# Altium project CT8042.PrjPcb (part 1 of 2)
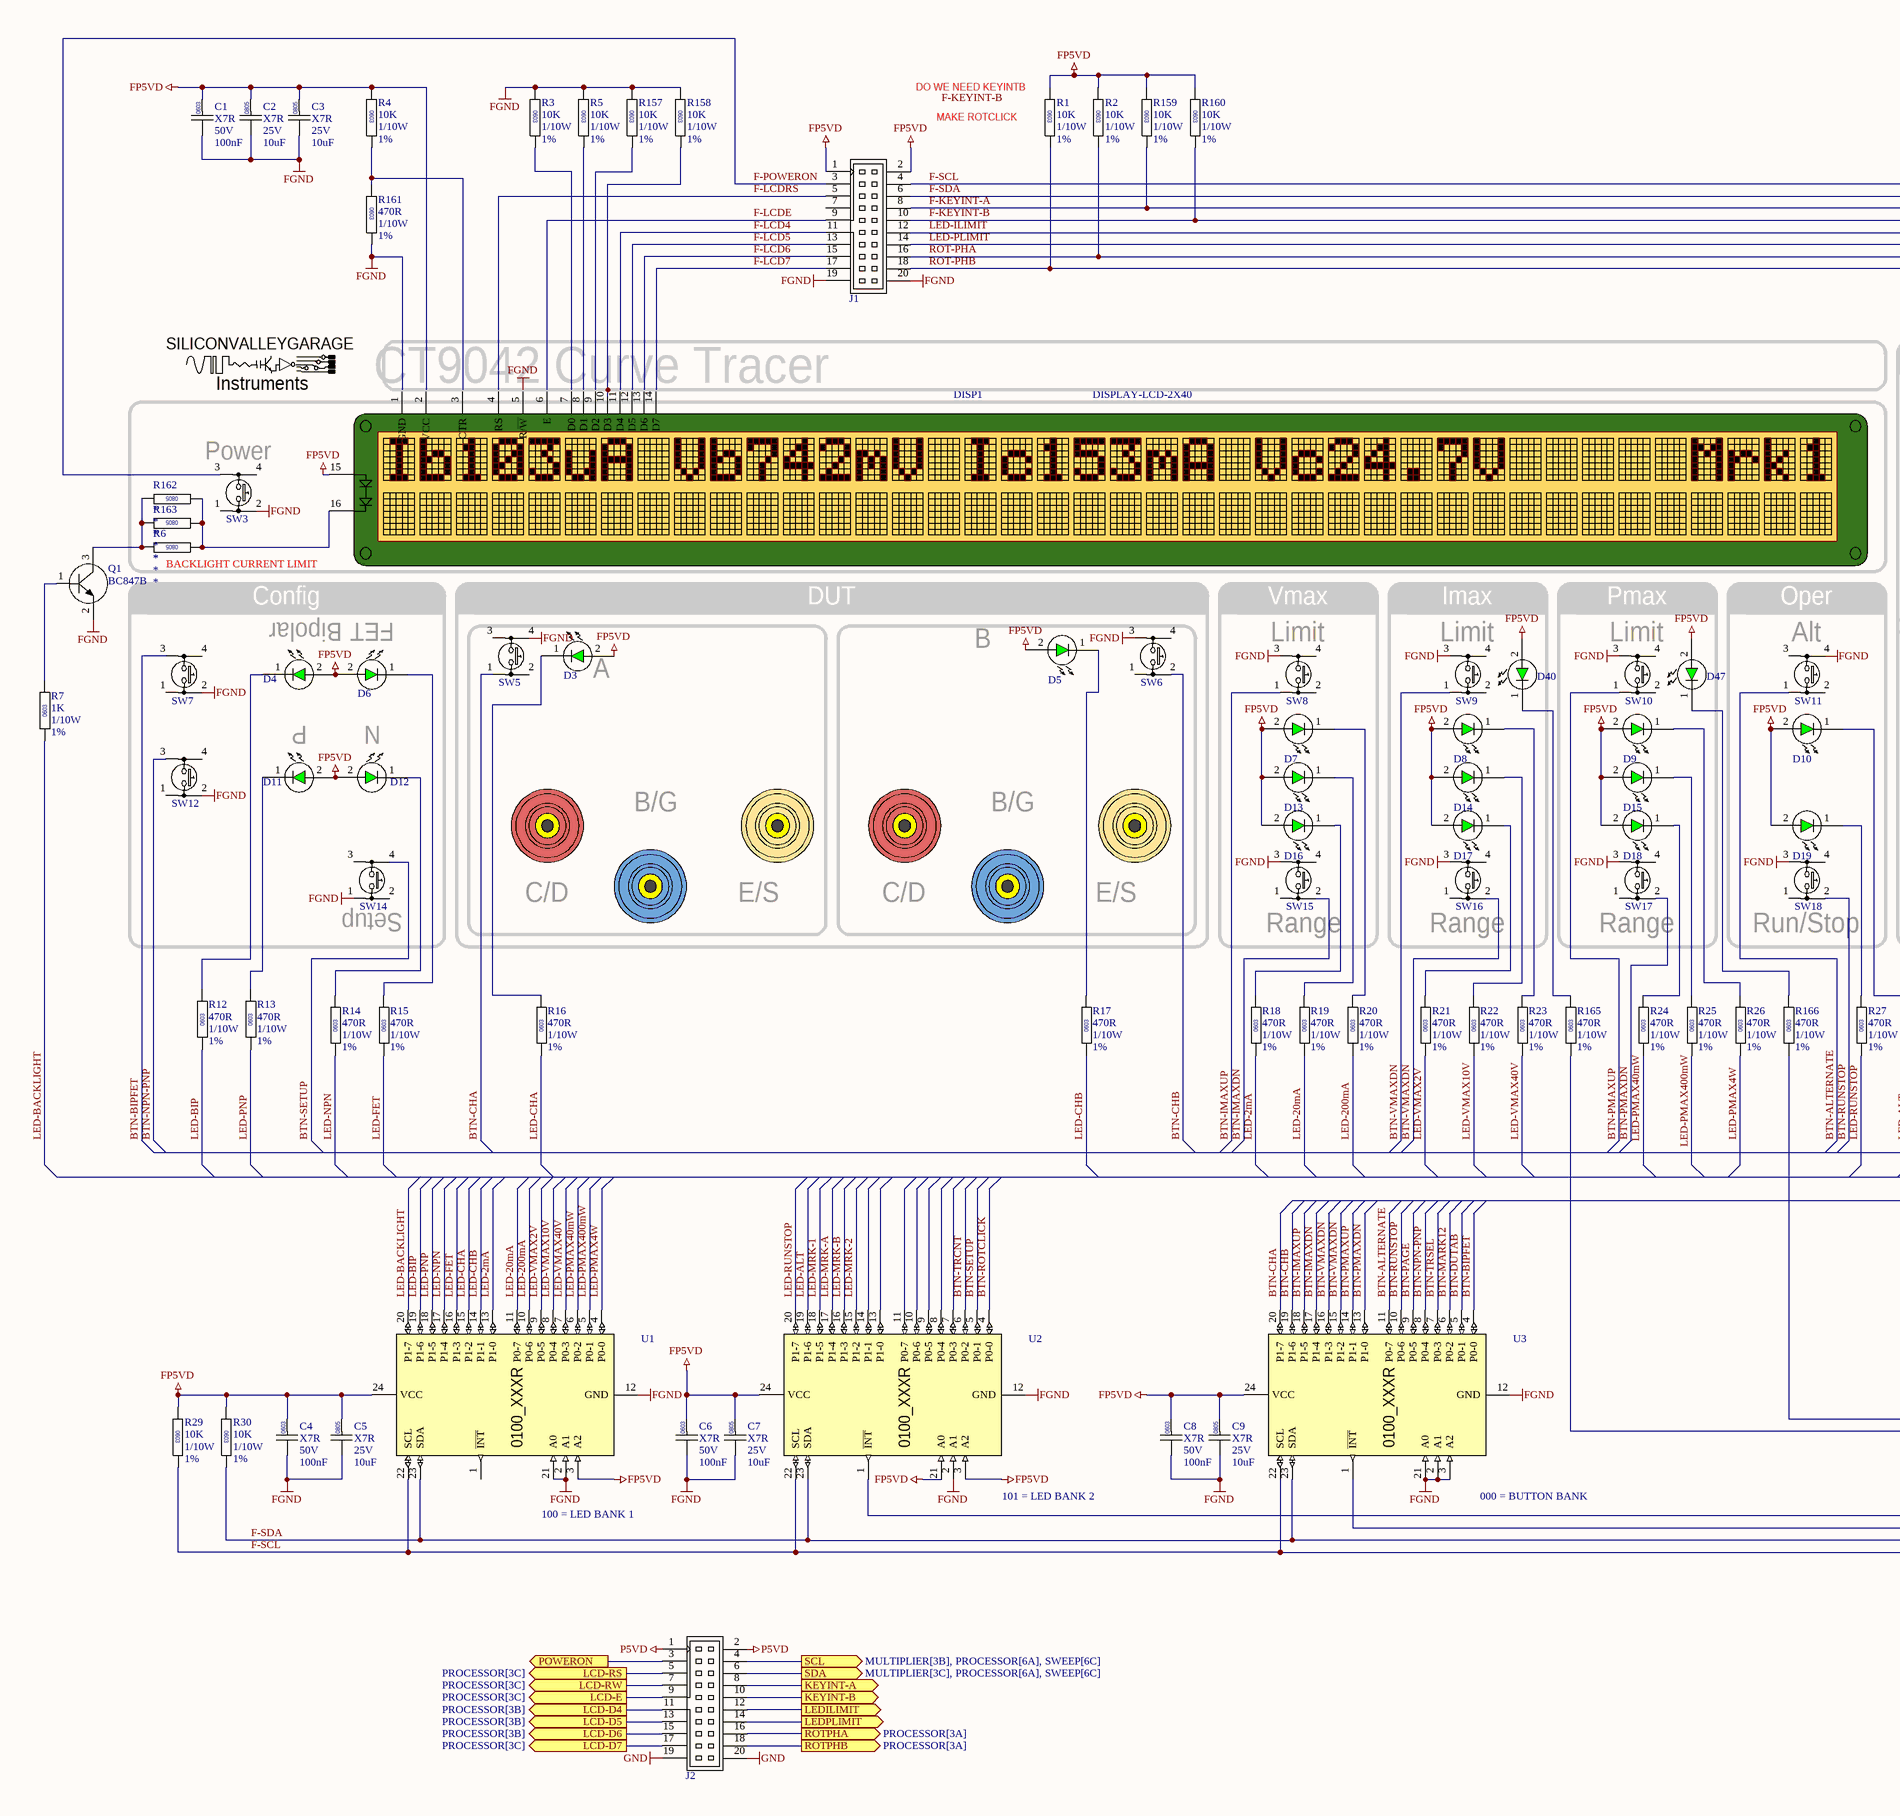
[diagram p0: FrontPanel.SchDoc, left]
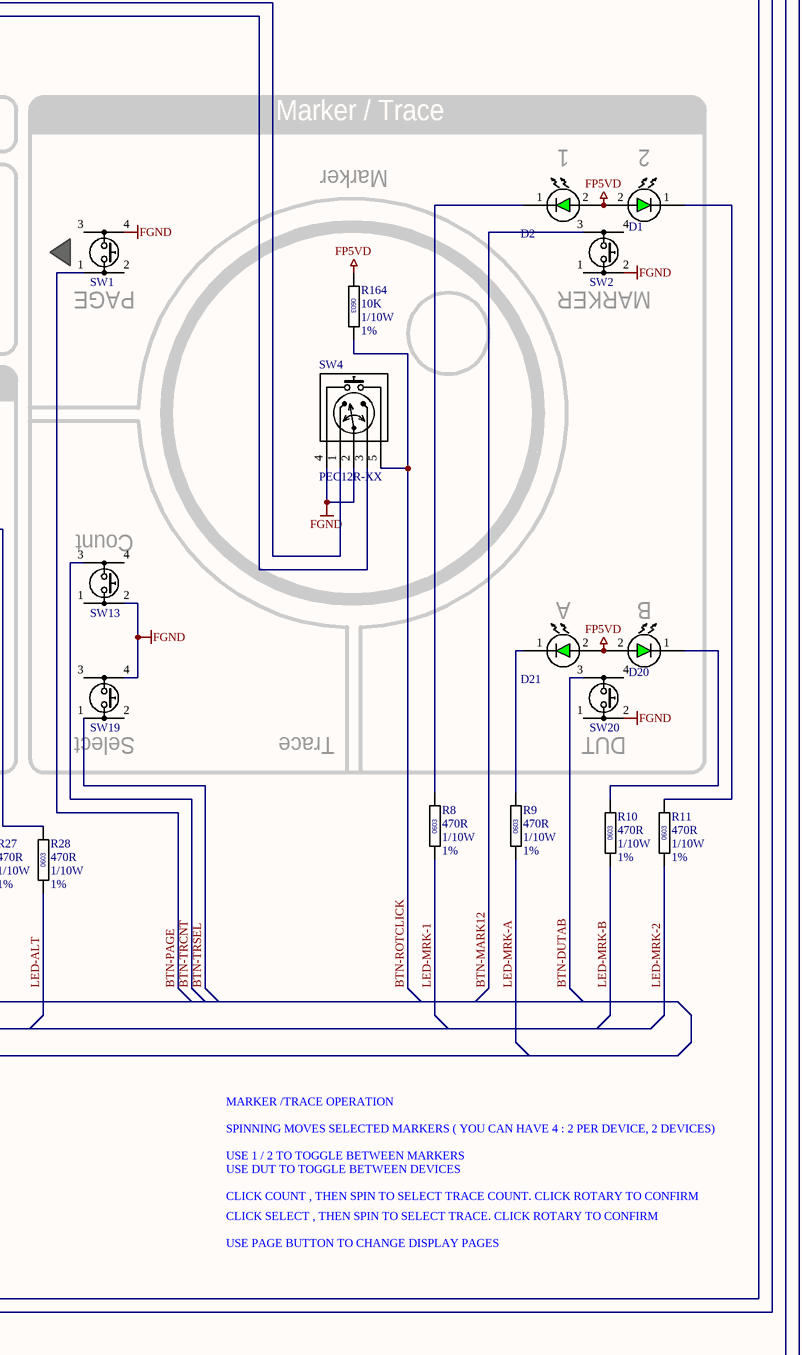
[diagram p1: FrontPanel.SchDoc, right]
SCHdrafter: free_electron
10 sheets, 479 parts. Net scope: hierarchical (ports join the sheet entries above them; power ports are global).
Board file: CT8042.PcbDoc
Sheets:
  FrontPanel.SchDoc
  PROCESSOR.SchDoc
  CT8042 Toplevel.SchDoc
    U_PSU = PSU.SchDoc
    U_POWERAMP = POWERAMP.SchDoc
    U_IBVG-DRIVER = IBVG-DRIVER.SchDoc
    U_SWEEP = SWEEP.SchDoc
    U_MULTIPLIER = MULTIPLIER.SchDoc
    U_PSU48 = PSU48.SchDoc
    U_POWERMUX = POWERMUX.SchDoc

## Sheet FrontPanel.SchDoc
size A2; SheetNumber: 2; SheetTotal: 9

### Parts
C1  Dielectric: X7R  Voltage: 50V  Capacitance: 100nF  [CAPC0603]  (hidden comment: CAP0603)
C2  Dielectric: X7R  Voltage: 25V  Capacitance: 10uF  [CAPC0805]  (hidden comment: CAP0805)
C3  Dielectric: X7R  Voltage: 25V  Capacitance: 10uF  [CAPC0805]  (hidden comment: CAP0805)
C4  Dielectric: X7R  Voltage: 50V  Capacitance: 100nF  [CAPC0603]  (hidden comment: CAP0603)
C5  Dielectric: X7R  Voltage: 25V  Capacitance: 10uF  [CAPC0805]  (hidden comment: CAP0805)
C6  Dielectric: X7R  Voltage: 50V  Capacitance: 100nF  [CAPC0603]  (hidden comment: CAP0603)
C7  Dielectric: X7R  Voltage: 25V  Capacitance: 10uF  [CAPC0805]  (hidden comment: CAP0805)
C8  Dielectric: X7R  Voltage: 50V  Capacitance: 100nF  [CAPC0603]  (hidden comment: CAP0603)
C9  Dielectric: X7R  Voltage: 25V  Capacitance: 10uF  [CAPC0805]  (hidden comment: CAP0805)
D1  LED-3MM-GREEN  [LED-3MM-GREEN]  (value not drawn)
D2  LED-3MM-GREEN  [LED-3MM-GREEN]  (value not drawn)
D3  LED-3MM-GREEN  [LED-3MM-GREEN]  (value not drawn)
D4  LED-3MM-GREEN  [LED-3MM-GREEN]  (value not drawn)
D5  LED-3MM-GREEN  [LED-3MM-GREEN]  (value not drawn)
D6  LED-3MM-GREEN  [LED-3MM-GREEN]  (value not drawn)
D7  LED-3MM-GREEN  [LED-3MM-GREEN]  (value not drawn)
D8  LED-3MM-GREEN  [LED-3MM-GREEN]  (value not drawn)
D9  LED-3MM-GREEN  [LED-3MM-GREEN]  (value not drawn)
D10  LED-3MM-GREEN  [LED-3MM-GREEN]  (value not drawn)
D11  LED-3MM-GREEN  [LED-3MM-GREEN]  (value not drawn)
D12  LED-3MM-GREEN  [LED-3MM-GREEN]  (value not drawn)
D13  LED-3MM-GREEN  [LED-3MM-GREEN]  (value not drawn)
D14  LED-3MM-GREEN  [LED-3MM-GREEN]  (value not drawn)
D15  LED-3MM-GREEN  [LED-3MM-GREEN]  (value not drawn)
D16  LED-3MM-GREEN  [LED-3MM-GREEN]  (value not drawn)
D17  LED-3MM-GREEN  [LED-3MM-GREEN]  (value not drawn)
D18  LED-3MM-GREEN  [LED-3MM-GREEN]  (value not drawn)
D19  LED-3MM-GREEN  [LED-3MM-GREEN]  (value not drawn)
D20  LED-3MM-GREEN  [LED-3MM-GREEN]  (value not drawn)
D21  LED-3MM-GREEN  [LED-3MM-GREEN]  (value not drawn)
D40  LED-3MM-GREEN  [LED-3MM-GREEN]  (value not drawn)
D47  LED-3MM-GREEN  [LED-3MM-GREEN]  (value not drawn)
DISP1  DISPLAY-LCD-2X40  [CONNECTOR-GENERIC-PINHEADER-2X8]
J1  BOXHEADER-10X2  [CONNECTOR GENERIC-BOXHEADER-2X10]  (value not drawn)
J2  BOXHEADER-10X2  [CONNECTOR GENERIC-BOXHEADER-2X10]  (value not drawn)
LOGO?  LOGO-SILICONVALLEYGARAGE-SMALL  [SILICONVALLEYGARAGE]  (value not drawn)  (graphical)
Q1  BC847B  [SOT23]
R1  value 10K  Power: 1/10W  Tolerance: 1%  [RESC0603]  (hidden comment: RESC0603)
R2  value 10K  Power: 1/10W  Tolerance: 1%  [RESC0603]  (hidden comment: RESC0603)
R3  value 10K  Power: 1/10W  Tolerance: 1%  [RESC0603]  (hidden comment: RESC0603)
R4  value 10K  Power: 1/10W  Tolerance: 1%  [RESC0603]  (hidden comment: RESC0603)
R5  value 10K  Power: 1/10W  Tolerance: 1%  [RESC0603]  (hidden comment: RESC0603)
R6  RESC0805  [RESC0805]  (value not drawn)
R7  value 1K  Power: 1/10W  Tolerance: 1%  [RESC0603]  (hidden comment: RESC0603)
R8  value 470R  Power: 1/10W  Tolerance: 1%  [RESC0603]  (hidden comment: RESC0603)
R9  value 470R  Power: 1/10W  Tolerance: 1%  [RESC0603]  (hidden comment: RESC0603)
R10  value 470R  Power: 1/10W  Tolerance: 1%  [RESC0603]  (hidden comment: RESC0603)
R11  value 470R  Power: 1/10W  Tolerance: 1%  [RESC0603]  (hidden comment: RESC0603)
R12  value 470R  Power: 1/10W  Tolerance: 1%  [RESC0603]  (hidden comment: RESC0603)
R13  value 470R  Power: 1/10W  Tolerance: 1%  [RESC0603]  (hidden comment: RESC0603)
R14  value 470R  Power: 1/10W  Tolerance: 1%  [RESC0603]  (hidden comment: RESC0603)
R15  value 470R  Power: 1/10W  Tolerance: 1%  [RESC0603]  (hidden comment: RESC0603)
R16  value 470R  Power: 1/10W  Tolerance: 1%  [RESC0603]  (hidden comment: RESC0603)
R17  value 470R  Power: 1/10W  Tolerance: 1%  [RESC0603]  (hidden comment: RESC0603)
R18  value 470R  Power: 1/10W  Tolerance: 1%  [RESC0603]  (hidden comment: RESC0603)
R19  value 470R  Power: 1/10W  Tolerance: 1%  [RESC0603]  (hidden comment: RESC0603)
R20  value 470R  Power: 1/10W  Tolerance: 1%  [RESC0603]  (hidden comment: RESC0603)
R21  value 470R  Power: 1/10W  Tolerance: 1%  [RESC0603]  (hidden comment: RESC0603)
R22  value 470R  Power: 1/10W  Tolerance: 1%  [RESC0603]  (hidden comment: RESC0603)
R23  value 470R  Power: 1/10W  Tolerance: 1%  [RESC0603]  (hidden comment: RESC0603)
R24  value 470R  Power: 1/10W  Tolerance: 1%  [RESC0603]  (hidden comment: RESC0603)
R25  value 470R  Power: 1/10W  Tolerance: 1%  [RESC0603]  (hidden comment: RESC0603)
R26  value 470R  Power: 1/10W  Tolerance: 1%  [RESC0603]  (hidden comment: RESC0603)
R27  value 470R  Power: 1/10W  Tolerance: 1%  [RESC0603]  (hidden comment: RESC0603)
R28  value 470R  Power: 1/10W  Tolerance: 1%  [RESC0603]  (hidden comment: RESC0603)
R29  value 10K  Power: 1/10W  Tolerance: 1%  [RESC0603]  (hidden comment: RESC0603)
R30  value 10K  Power: 1/10W  Tolerance: 1%  [RESC0603]  (hidden comment: RESC0603)
R157  value 10K  Power: 1/10W  Tolerance: 1%  [RESC0603]  (hidden comment: RESC0603)
R158  value 10K  Power: 1/10W  Tolerance: 1%  [RESC0603]  (hidden comment: RESC0603)
R159  value 10K  Power: 1/10W  Tolerance: 1%  [RESC0603]  (hidden comment: RESC0603)
R160  value 10K  Power: 1/10W  Tolerance: 1%  [RESC0603]  (hidden comment: RESC0603)
R161  value 470R  Power: 1/10W  Tolerance: 1%  [RESC0603]  (hidden comment: RESC0603)
R162  RESC0805  [RESC0805]  (value not drawn)
R163  RESC0805  [RESC0805]  (value not drawn)
R164  value 10K  Power: 1/10W  Tolerance: 1%  [RESC0603]  (hidden comment: RESC0603)
R165  value 470R  Power: 1/10W  Tolerance: 1%  [RESC0603]  (hidden comment: RESC0603)
R166  value 470R  Power: 1/10W  Tolerance: 1%  [RESC0603]  (hidden comment: RESC0603)
SW1  SWITCH-E-SWITCH-TL1105SFP  [SWITCH-ESWITCH-TL1105SPF-1RCAP]  (value not drawn)
SW2  SWITCH-E-SWITCH-TL1105SFP  [SWITCH-ESWITCH-TL1105SPF-1RCAP]  (value not drawn)
SW3  SWITCH-E-SWITCH-TL1105SFP  [SWITCH-ESWITCH-TL1105SPF-1RCAP]  (value not drawn)
SW4  PEC12R-XX
SW5  SWITCH-E-SWITCH-TL1105SFP  [SWITCH-ESWITCH-TL1105SPF-1RCAP]  (value not drawn)
SW6  SWITCH-E-SWITCH-TL1105SFP  [SWITCH-ESWITCH-TL1105SPF-1RCAP]  (value not drawn)
SW7  SWITCH-E-SWITCH-TL1105SFP  [SWITCH-ESWITCH-TL1105SPF-1RCAP]  (value not drawn)
SW8  SWITCH-E-SWITCH-TL1105SFP  [SWITCH-ESWITCH-TL1105SPF-1RCAP]  (value not drawn)
SW9  SWITCH-E-SWITCH-TL1105SFP  [SWITCH-ESWITCH-TL1105SPF-1RCAP]  (value not drawn)
SW10  SWITCH-E-SWITCH-TL1105SFP  [SWITCH-ESWITCH-TL1105SPF-1RCAP]  (value not drawn)
SW11  SWITCH-E-SWITCH-TL1105SFP  [SWITCH-ESWITCH-TL1105SPF-1RCAP]  (value not drawn)
SW12  SWITCH-E-SWITCH-TL1105SFP  [SWITCH-ESWITCH-TL1105SPF-1RCAP]  (value not drawn)
SW13  SWITCH-E-SWITCH-TL1105SFP  [SWITCH-ESWITCH-TL1105SPF-1RCAP]  (value not drawn)
SW14  SWITCH-E-SWITCH-TL1105SFP  [SWITCH-ESWITCH-TL1105SPF-1RCAP]  (value not drawn)
SW15  SWITCH-E-SWITCH-TL1105SFP  [SWITCH-ESWITCH-TL1105SPF-1RCAP]  (value not drawn)
SW16  SWITCH-E-SWITCH-TL1105SFP  [SWITCH-ESWITCH-TL1105SPF-1RCAP]  (value not drawn)
SW17  SWITCH-E-SWITCH-TL1105SFP  [SWITCH-ESWITCH-TL1105SPF-1RCAP]  (value not drawn)
SW18  SWITCH-E-SWITCH-TL1105SFP  [SWITCH-ESWITCH-TL1105SPF-1RCAP]  (value not drawn)
SW19  SWITCH-E-SWITCH-TL1105SFP  [SWITCH-ESWITCH-TL1105SPF-1RCAP]  (value not drawn)
SW20  SWITCH-E-SWITCH-TL1105SFP  [SWITCH-ESWITCH-TL1105SPF-1RCAP]  (value not drawn)
U1  PCAL9555  (value not drawn)
U2  PCAL9555  (value not drawn)
U3  PCAL9555  (value not drawn)

### Blocks framed on the sheet
Marker / Trace: D1 D2 D20 D21 R164 SW1 SW2 SW4 SW13 SW19 SW20
Power: DISP1 R6 R162 R163 SW3

### Ports
KEYINT-A (out), KEYINT-B (out), LCD-D4 (out, see PROCESSOR[3B]), LCD-D5 (out, see PROCESSOR[3B]), LCD-D6 (out, see PROCESSOR[3B]), LCD-D7 (out, see PROCESSOR[3C]), LCD-E (out, see PROCESSOR[3C]), LCD-RS (out, see PROCESSOR[3C]), LCD-RW (out, see PROCESSOR[3C]), LEDILIMIT (out), LEDPLIMIT (out), POWERON (out), ROTPHA (out, see PROCESSOR[3A]), ROTPHB (out, see PROCESSOR[3A]), SCL (out, see MULTIPLIER[3B], PROCESSOR[6A], SWEEP[6C]), SDA (out, see MULTIPLIER[3C], PROCESSOR[6A], SWEEP[6C])

### Nets
FGND: C1.2 C2.2 C3.2 C4.2 C5.2 C6.2 C7.2 C8.2 C9.2 DISP1.1(GND) DISP1.5(R/~{W}) J1.19(-) J1.20(-) Q1.2(E) R3.2 R5.2 R157.2 R158.2 R161.1 SW1.4 SW2.2 SW3.2 SW4.2 SW4.4 SW5.4 SW6.3 SW7.2 SW8.3 SW9.3 SW10.3 SW11.4 SW12.2 SW13.2 SW14.1 SW15.3 SW16.3 SW17.3 SW18.3 SW19.4 SW20.2 U1.2(A1) U1.12(GND) U1.21(A0) U2.2(A1) U2.12(GND) U3.2(A1) U3.3(A2) U3.12(GND) U3.21(A0)
FP5VD: C1.1 C2.1 C3.1 C4.1 C5.1 C6.1 C7.1 C8.1 C9.1 D1.2(K) D2.2(K) D3.2(K) D4.2(K) D5.2(K) D6.2(K) D7.2(K) D8.2(K) D9.2(K) D10.2(K) D11.2(K) D12.2(K) D13.2(K) D14.2(K) D15.2(K) D16.2(K) D17.2(K) D18.2(K) D19.2(K) D20.2(K) D21.2(K) D40.2(K) D47.2(K) DISP1.2(VCC) DISP1.15(LED+) J1.1(+) J1.2(-) R1.2 R2.2 R4.2 R29.2 R30.2 R159.2 R160.2 R164.2 U1.3(A2) U1.24(VCC) U2.3(A2) U2.21(A0) U2.24(VCC) U3.24(VCC)
GND: J2.19(-) J2.20(-)
P5VD: J2.1(+) J2.2(-)
BTN-ALTERNATE: SW11.1 U3.11(P0-7)
BTN-BIPFET: SW7.3 U3.4(P0-0)
BTN-CHA: SW5.1 U3.20(P1-7)
BTN-CHB: SW6.2 U3.19(P1-6)
BTN-DUTAB: SW20.3 U3.5(P0-1)
BTN-IMAXDN: SW15.2 U3.17(P1-4)
BTN-IMAXUP: SW8.1 U3.18(P1-5)
BTN-MARK12: SW2.3 U3.6(P0-2)
BTN-NPN-PNP: SW12.3 U3.8(P0-4)
BTN-PAGE: SW1.1 U3.9(P0-5)
BTN-PMAXDN: SW17.2 U3.13(P1-0)
BTN-PMAXUP: SW10.1 U3.14(P1-1)
BTN-ROTCLICK: R164.1 SW4.5 U2.4(P0-0)
BTN-RUNSTOP: SW18.2 U3.10(P0-6)
BTN-SETUP: SW14.4 U2.5(P0-1)
BTN-TRCNT: SW13.3 U2.6(P0-2)
BTN-TRSEL: SW19.1 U3.7(P0-3)
BTN-VMAXDN: SW9.1 SW16.2 U3.15(P1-2) U3.16(P1-3)
F-KEYINT-A: J1.8(-) R159.1 U3.1(~{INT})
F-KEYINT-B: J1.10(-) R160.1 U2.1(~{INT})
F-LCD4: DISP1.11(D4) J1.11(-)
F-LCD5: DISP1.12(D5) J1.13(-)
F-LCD6: DISP1.13(D6) J1.15(-)
F-LCD7: DISP1.14(D7) J1.17(-)
F-LCDE: DISP1.6(E) J1.9(-)
F-LCDRS: DISP1.4(RS) J1.5(-)
F-POWERON: J1.3(-) SW3.3
F-SCL: J1.4(-) R29.1 U1.22(SCL) U2.22(SCL) U3.22(SCL)
F-SDA: J1.6(-) R30.1 U1.23(SDA) U2.23(SDA) U3.23(SDA)
KEYINT-A: J2.8(-) ; port KEYINT-A
KEYINT-B: J2.10(-) ; port KEYINT-B
LCD-D4: J2.11(-) ; port LCD-D4
LCD-D5: J2.13(-) ; port LCD-D5
LCD-D6: J2.15(-) ; port LCD-D6
LCD-D7: J2.17(-) ; port LCD-D7
LCD-E: J2.9(-) ; port LCD-E
LCD-RS: J2.5(-) ; port LCD-RS
LCD-RW: J2.7(-) ; port LCD-RW
LED-2mA: R18.2 U1.13(P1-0)
LED-20mA: R19.2 U1.11(P0-7)
LED-200mA: R20.2 U1.10(P0-6)
LED-ALT: R28.2 U2.19(P1-6)
LED-BACKLIGHT: R7.2 U1.20(P1-7)
LED-BIP: R12.2 U1.19(P1-6)
LED-CHA: R16.2 U1.15(P1-2)
LED-CHB: R17.2 U1.14(P1-1)
LED-FET: R15.2 U1.16(P1-3)
LED-ILIMIT: J1.12(-) R165.2
LED-MRK-1: R8.2 U2.18(P1-5)
LED-MRK-2: R11.2 U2.15(P1-2)
LED-MRK-A: R9.2 U2.17(P1-4)
LED-MRK-B: R10.2 U2.16(P1-3)
LED-NPN: R14.2 U1.17(P1-4)
LED-PLIMIT: J1.14(-) R166.2
LED-PMAX4W: R26.2 U1.4(P0-0)
LED-PMAX40mW: R24.2 U1.6(P0-2)
LED-PMAX400mW: R25.2 U1.5(P0-1)
LED-PNP: R13.2 U1.18(P1-5)
LED-RUNSTOP: R27.2 U2.20(P1-7)
LED-VMAX2V: R21.2 U1.9(P0-5)
LED-VMAX10V: R22.2 U1.8(P0-4)
LED-VMAX40V: R23.2 U1.7(P0-3)
LEDILIMIT: J2.12(-) ; port LEDILIMIT
LEDPLIMIT: J2.14(-) ; port LEDPLIMIT
POWERON: J2.3(-) ; port POWERON
ROT-PHA: J1.16(-) R2.1 SW4.1
ROT-PHB: J1.18(-) R1.1 SW4.3
ROTPHA: J2.16(-) ; port ROTPHA
ROTPHB: J2.18(-) ; port ROTPHB
SCL: J2.4(-) ; port SCL
SDA: J2.6(-) ; port SDA
NetD1_1: D1.1(A) R11.1
NetD2_1: D2.1(A) R8.1
NetD3_1: D3.1(A) R16.1
NetD4_1: D4.1(A) R12.1
NetD5_1: D5.1(A) R17.1
NetD6_1: D6.1(A) R15.1
NetD7_1: D7.1(A) R20.1
NetD8_1: D8.1(A) R23.1
NetD9_1: D9.1(A) R26.1
NetD10_1: D10.1(A) R28.1
NetD11_1: D11.1(A) R13.1
NetD12_1: D12.1(A) R14.1
NetD13_1: D13.1(A) R19.1
NetD14_1: D14.1(A) R22.1
NetD15_1: D15.1(A) R25.1
NetD16_1: D16.1(A) R18.1
NetD17_1: D17.1(A) R21.1
NetD18_1: D18.1(A) R24.1
NetD19_1: D19.1(A) R27.1
NetD20_1: D20.1(A) R10.1
NetD21_1: D21.1(A) R9.1
NetD40_1: D40.1(A) R165.1
NetD47_1: D47.1(A) R166.1
NetDISP1_3: DISP1.3(CTR) R4.1 R161.2
NetDISP1_7: DISP1.7(D0) R3.1
NetDISP1_8: DISP1.8(D1) R5.1
NetDISP1_9: DISP1.9(D2) R157.1
NetDISP1_10: DISP1.10(D3) R158.1
NetDISP1_16: DISP1.16(LED-) R6.2 R162.2 R163.2
NetQ1_1: Q1.1(B) R7.1
NetQ1_3: Q1.3(C) R6.1 R162.1 R163.1

Not connected (* = marked no-connect by the designer): J1 7(-); SW1 2 3; SW2 1 4; SW3 1 4; SW5 2 3; SW6 1 4; SW7 1 4; SW8 2 4; SW9 2 4; SW10 2 4; SW11 2 3; SW12 1 4; SW13 1 4; SW14 2 3; SW15 1 4; SW16 1 4; SW17 1 4; SW18 1 4; SW19 2 3; SW20 1 4; U1 1(~{INT}); U2 7(P0-3) 8(P0-4) 9(P0-5) 10(P0-6) 11(P0-7) 13(P1-0) 14(P1-1)

### Notes on the sheet
- (near R1) DO WE NEED KEYINTB
- (near R1) MAKE ROTCLICK
- (near LOGO?) Instruments
- (near DISP1) CT9042 Curve Tracer
- (near D2) 1
- (near D1) 2
- Marker
- (near SW1) PAGE
- (near SW2) MARKER
- (near R6) BACKLIGHT CURRENT LIMIT
- Config
- Bipolar
- (near D6) FET
- DUT
- B
- (near SW8) Vmax
- (near SW8) Limit
- Imax
- (near SW9) Limit
- Pmax
- (near SW10) Limit
- (near SW11) Alt
- (near SW11) Oper
- (near D3) A
- (near D11) P
- (near D12) N
- (near SW13) Count
- B/G
- (near D21) A
- (near D20) B
- (near SW14) Setup
- C/D
- E/S
- (near SW15) Range
- (near SW16) Range
- (near SW17) Range
- (near SW18) Run/Stop
- (near SW19) Select
- Trace
- (near SW20) DUT
- MARKER /TRACE OPERATION
- USE 1 / 2 TO TOGGLE BETWEEN MARKERS
- USE DUT TO TOGGLE BETWEEN DEVICES
- SPINNING MOVES SELECTED MARKERS ( YOU CAN HAVE 4 : 2 PER DEVICE, 2 DEVICES)
- CLICK COUNT , THEN SPIN TO SELECT TRACE COUNT. CLICK ROTARY TO CONFIRM
- CLICK SELECT , THEN SPIN TO SELECT TRACE. CLICK ROTARY TO CONFIRM
- USE PAGE BUTTON TO CHANGE DISPLAY PAGES
- 100 = LED BANK 1
- (near U2) 101 = LED BANK 2
- (near U3) 000 = BUTTON BANK
- Labels drawn without touching a wire or pin: F-KEYINT-B
- (in symbol CAPC-0805-10uF-25V) 0805
- (in symbol IC-NEXPERIA-PCAL9555A) 0100_XXXR
- (in symbol LOGO-SILICONVALLEYGARAGE-SMALL) SILICONVALLEYGARAGE
- (in symbol RESC-0603-1K-1%-1/10W) 0603
- (in symbol RESC-0603-10K-1%-1/10W) 0603
- (in symbol RESC-0603-470R-1%-1/10W) 0603
- (in symbol RESC-0805-GENERIC) 0805

### Library data of the parts
C1 C4 C6 C8 = CAPC-0603-100nF-50V-X7R: CAPACITOR,CERAMIC,100nF,50V,X7R,0603; Manufacturer 1: KEMET; Manufacturer Part Number 1: C0603C104K5RACTU; Package / Case: 0603; Location: *; Supplier 1: Mouser; Supplier Part Number 1: 80-C0603C104K5R7867; Supplier 2: Mouser; Supplier Part Number 2: 80-C0603C104K5R7411; Supplier 3: Avnet; Supplier Part Number 3: KGM15BR71H104KT; Supplier 4: Digikey; Supplier Part Number 4: 1276-1000-1-ND; LCSC: C127833; MOUSER: 80-C0603C104K5R
C2 C3 C5 C7 C9 = CAPC-0805-10uF-25V: CAPACITOR,CERAMIC,10uF,25V,X5R,0805; Manufacturer 1: SAMSUNG; Manufacturer Part Number 1: CL21B106KAYQNNE; Package / Case: 0805 (2012 metric); Location: *; LCSC: C3039694; MOUSER: 187-CL21B106KAYQNNE
D1-D21 D40 D47 = LED-3MM-GREEN: LED,TH,GREEN,42mCd,3MM; Manufacturer 1: WURTH; Manufacturer Part Number 1: 151031VS06000; MOUSER: 78-VLMPG33N1P2; Supplier 1: Mouser; Supplier Part Number 1: 78-VLMPG33N1P2
DISP1 = DISPLAY-LCD-2X40: DISPLAY,LCD,ALPHA,2X40CHAR,HD44780,YELLOW BL
J1 J2 = CONN-BOXHEADER-10X2
LOGO? = LOGO-SILICONVALLEYGARAGE-SMALL: LOGO,SILICONVALLEYGARAGE,SMALL
Q1 = XSTR-NPN-BC847: XSTR,NPN,45V,0.1A,,BC847B,SOT23
R1-R5 R29 R30 R157-R160 R164 = RESC-0603-10K-1%-1/10W: RESISTOR,10K,1%,100mW,0603 (1608); Manufacturer 1: YAGEO; Manufacturer Part Number 1: RC0603FR-0710KL; Location: *; LCSC: C25804; MOUSER: 603-RC0603FR-0710KL
R6 R162 R163 = RESC-0805-GENERIC: RESISTOR,GENERIC,0805; Location: *; Parameter 4: *; Power: *; Tolerance: *; Value: *
R7 = RESC-0603-1K-1%-1/10W: RESISTOR,1K,1%,100mW,0603 (1608); Manufacturer 1: YAGEO; Manufacturer Part Number 1: RC0603FR-071KL; Location: *; LCSC: C21190; MOUSER: 603-RC0603FR-071KL
R8-R28 R161 R165 R166 = RESC-0603-470R-1%-1/10W: RESISTOR,470R,1%,100mW,0603 (1608); Location: *; LCSC: C23179
SW1-SW3 SW5-SW20 = SWITCH-E-SWITCH-TL1105SFP: SW,SMD,TACT,4PIN,TH,160g TOP ACTUATOR FOR CAP,E-SWITCH,TL1105SPF160; Manufacturer Part Number 1: TL1105SPF160Q; DIGIKEY: EG1861-ND; Manufacturer 1: E-SWITCH
SW4 = SWITCH-BOURNS-PEC12R
U1-U3 = IC-NEXPERIA-PCAL9555A: I2C,16BIT AGILE I/O EXPANDER,INT,NEXPERIA,PCAL95555,TSSOP24; Manufacturer Part Number 1: PCAL9555APW,118; DIGIKEY: 568-9928-1-ND; LCSC: C2669740; Manufacturer 1: NEXPERIA

## Sheet PROCESSOR.SchDoc
size Tabloid; SheetNumber: 3; SheetTotal: 9
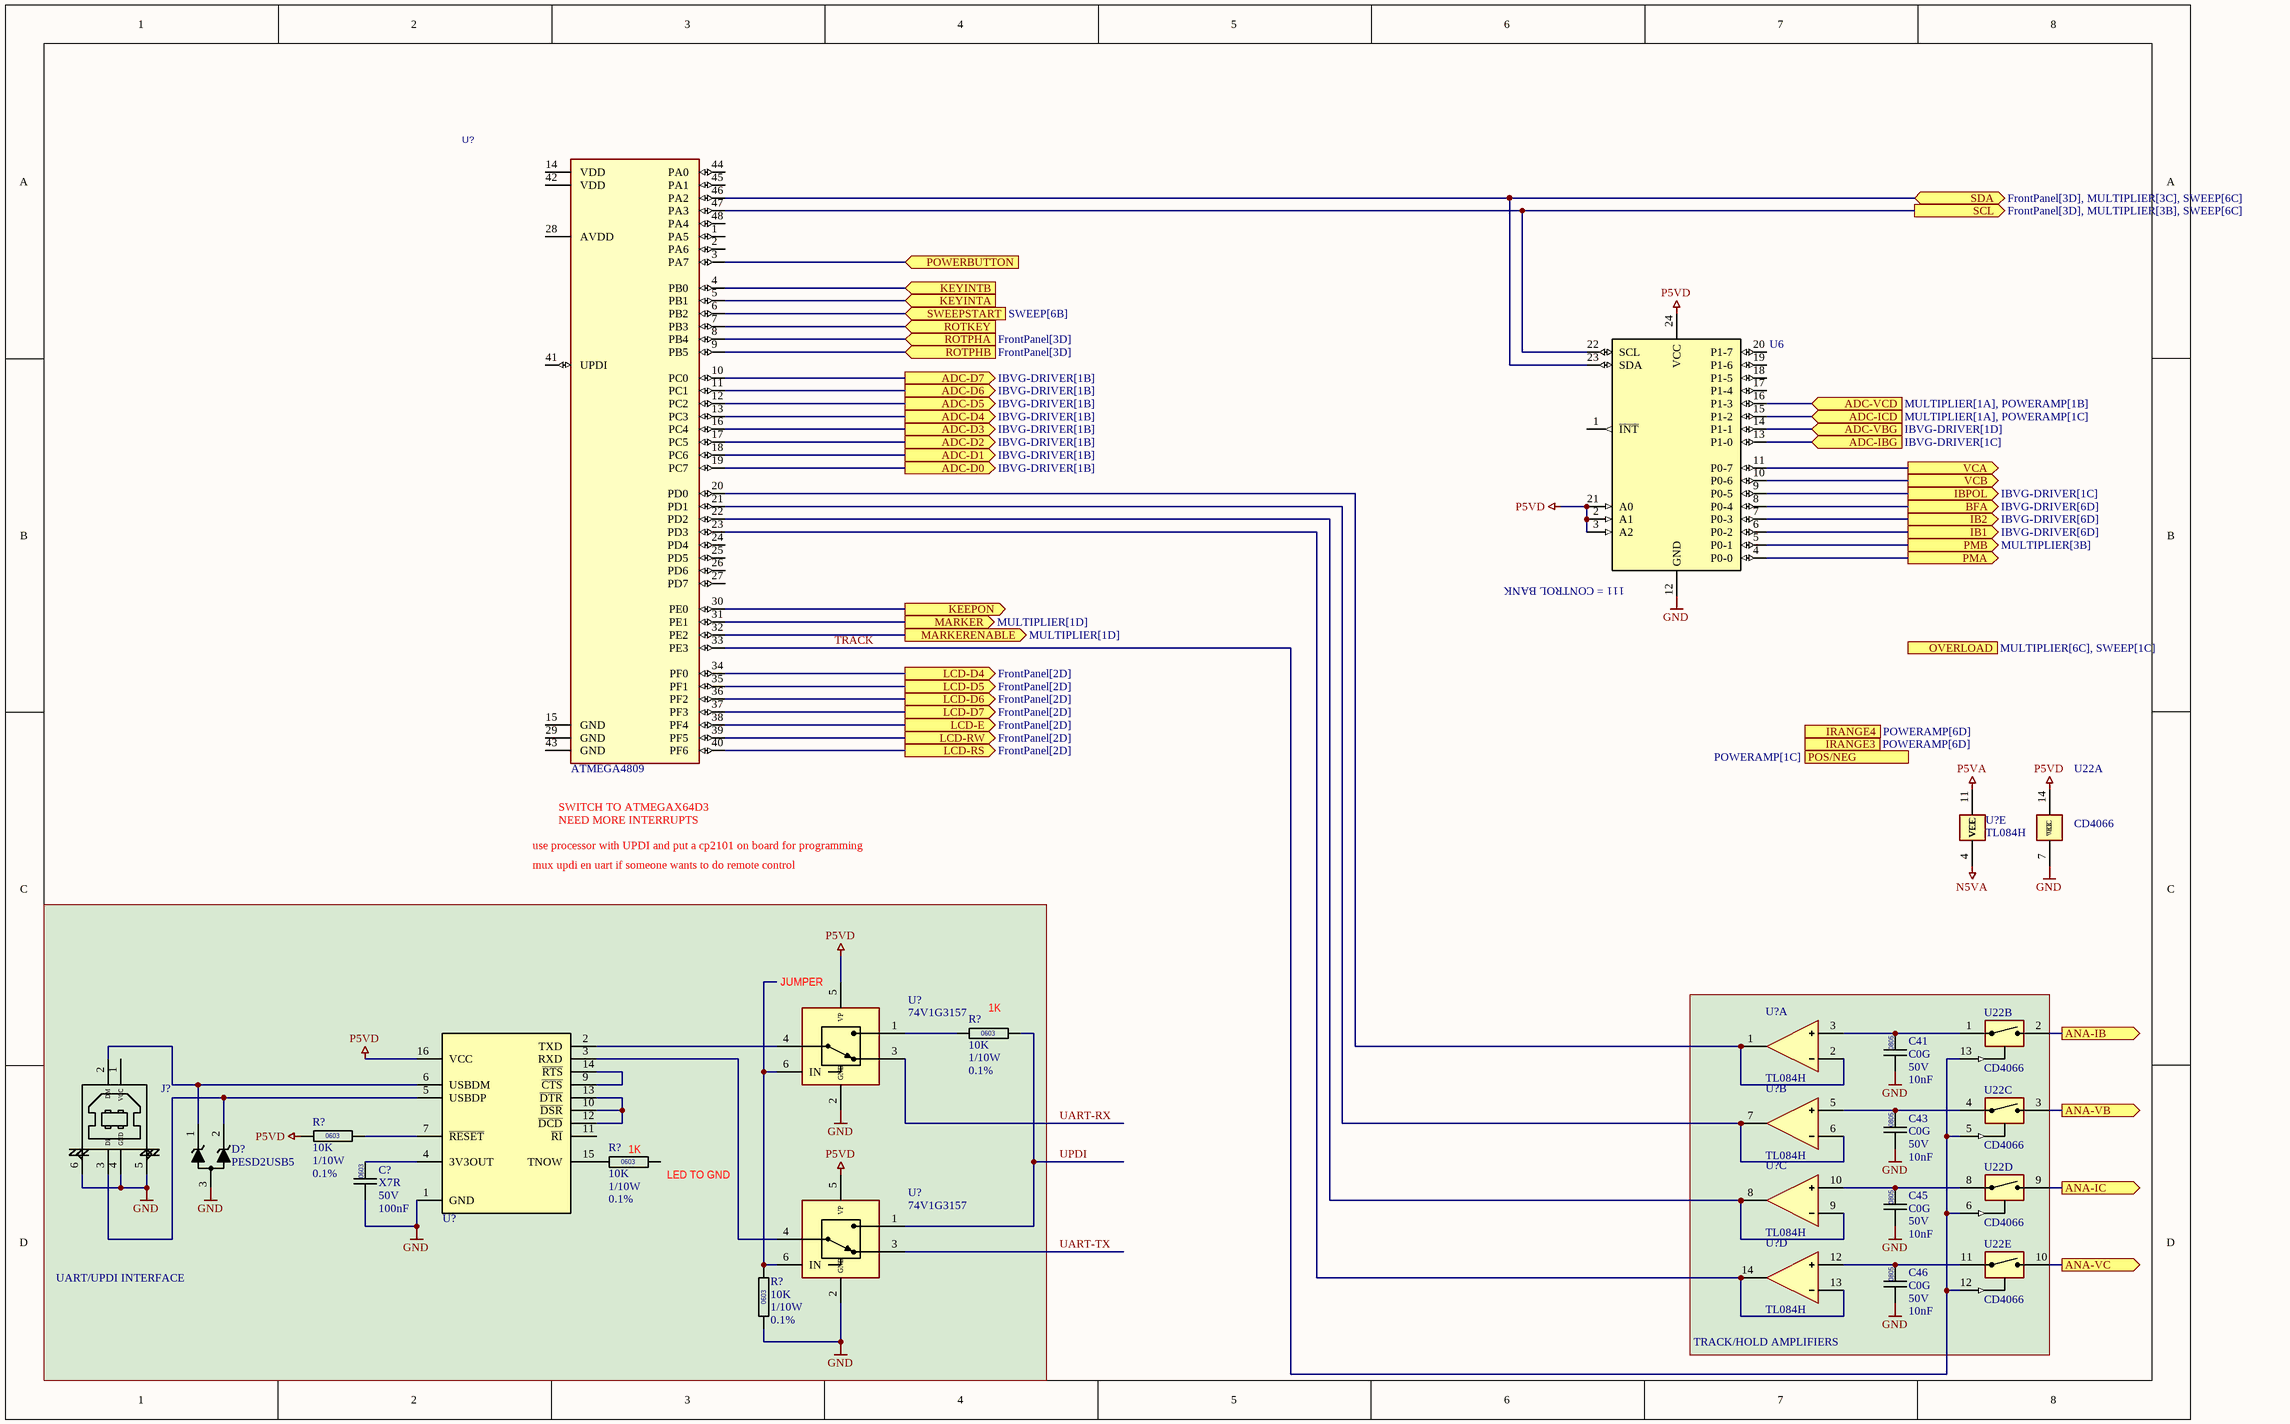
[diagram p2: PROCESSOR.SchDoc]

### Parts
(Parts that share a designator on the sheet are numbered #1, #2 ... from top to bottom, then left to right.)
C41  Dielectric: C0G  Voltage: 50V  Capacitance: 10nF  [CAPC0805]  (hidden comment: CAP0805)
C43  Dielectric: C0G  Voltage: 50V  Capacitance: 10nF  [CAPC0805]  (hidden comment: CAP0805)
C45  Dielectric: C0G  Voltage: 50V  Capacitance: 10nF  [CAPC0805]  (hidden comment: CAP0805)
C46  Dielectric: C0G  Voltage: 50V  Capacitance: 10nF  [CAPC0805]  (hidden comment: CAP0805)
C?#1  Dielectric: X7R  Voltage: 50V  Capacitance: 100nF  [CAPC0603]  (hidden comment: CAP0603)
D?#1  PESD2USB5  [SOT23]
J?  CONN-CUI-UJ2-BH-BL1-TH  (value not drawn)
R?#1  value 10K  Power: 1/10W  Tolerance: 0.1%  [RESC0603]  (hidden comment: RESC0603)
R?#2  value 10K  Power: 1/10W  Tolerance: 0.1%  [RESC0603]  (hidden comment: RESC0603)
R?#3  value 10K  Power: 1/10W  Tolerance: 0.1%  [RESC0603]  (hidden comment: RESC0603)
R?#4  value 10K  Power: 1/10W  Tolerance: 0.1%  [RESC0603]  (hidden comment: RESC0603)
U6  PCAL9555  (value not drawn)
U22  CD4066  [SO127P600-14N]  (parts A,B,C,D,E of 5)
U?#1  ATMEGA4809  [QFN50P700X700X-44-TH520X520]
U?#2  TL084H  [SO127P600-14N]  (part E of 5)
U?#3  74V1G3157  [SOT23-6]
U?#4  TL084H  [SO127P600-14N]  (part A of 5)
U?#5  CP2102  [SO127P600-16N]  (value not drawn)
U?#6  TL084H  [SO127P600-14N]  (part B of 5)
U?#7  TL084H  [SO127P600-14N]  (part C of 5)
U?#8  74V1G3157  [SOT23-6]
U?#9  TL084H  [SO127P600-14N]  (part D of 5)

### Blocks framed on the sheet
TRACK/HOLD AMPLIFIERS: C41 C43 C45 C46 U22 U?#4 U?#6 U?#7 U?#9

### Ports
ADC-D0 (out, see IBVG-DRIVER[1B]), ADC-D1 (out, see IBVG-DRIVER[1B]), ADC-D2 (out, see IBVG-DRIVER[1B]), ADC-D3 (out, see IBVG-DRIVER[1B]), ADC-D4 (out, see IBVG-DRIVER[1B]), ADC-D5 (out, see IBVG-DRIVER[1B]), ADC-D6 (out, see IBVG-DRIVER[1B]), ADC-D7 (out, see IBVG-DRIVER[1B]), ADC-IBG (in, see IBVG-DRIVER[1C]), ADC-ICD (in, see MULTIPLIER[1A], POWERAMP[1C]), ADC-VBG (in, see IBVG-DRIVER[1D]), ADC-VCD (in, see MULTIPLIER[1A], POWERAMP[1B]), ANA-IB (out), ANA-IC (out), ANA-VB (out), ANA-VC (out), BFA (out, see IBVG-DRIVER[6D]), IB1 (out, see IBVG-DRIVER[6D]), IB2 (out, see IBVG-DRIVER[6D]), IBPOL (out, see IBVG-DRIVER[1C]), IRANGE3 (out, see POWERAMP[6D]), IRANGE4 (out, see POWERAMP[6D]), KEEPON (out), KEYINTA (in), KEYINTB (in), LCD-D4 (out, see FrontPanel[2D]), LCD-D5 (out, see FrontPanel[2D]), LCD-D6 (out, see FrontPanel[2D]), LCD-D7 (out, see FrontPanel[2D]), LCD-E (out, see FrontPanel[2D]), LCD-RS (out, see FrontPanel[2D]), LCD-RW (out, see FrontPanel[2D]), MARKER (out, see MULTIPLIER[1D]), MARKERENABLE (out, see MULTIPLIER[1D]), OVERLOAD (in, see MULTIPLIER[6C], SWEEP[1C]), PMA (out), PMB (out, see MULTIPLIER[3B]), POS/NEG (out, see POWERAMP[1C]), POWERBUTTON (in), ROTKEY (in), ROTPHA (in, see FrontPanel[3D]), ROTPHB (in, see FrontPanel[3D]), SCL (out, see FrontPanel[3D], MULTIPLIER[3B], SWEEP[6C]), SDA (bidir, see FrontPanel[3D], MULTIPLIER[3C], SWEEP[6C]), SWEEPSTART (in, see SWEEP[6B]), VCA (out), VCB (out)

### Nets
GND: C41.2 C43.2 C45.2 C46.2 C?#1.2 D?#1.3(A) J?.4(GND) J?.5(NO) J?.6(NO) R?#4.2 U6.12(GND) U22.7(VEE) U?#3.2(GND) U?#5.1(GND) U?#8.2(GND)
N5VA: U?#2.4(VCC)
P5VA: U?#2.11(VEE)
P5VD: R?#2.2 U6.2(A1) U6.3(A2) U6.21(A0) U6.24(VCC) U22.14(VCC) U?#3.5(VP) U?#5.16(VCC) U?#8.5(VP)
ADC-D0: U?#1.19(PC7) ; port ADC-D0
ADC-D1: U?#1.18(PC6) ; port ADC-D1
ADC-D2: U?#1.17(PC5) ; port ADC-D2
ADC-D3: U?#1.16(PC4) ; port ADC-D3
ADC-D4: U?#1.13(PC3) ; port ADC-D4
ADC-D5: U?#1.12(PC2) ; port ADC-D5
ADC-D6: U?#1.11(PC1) ; port ADC-D6
ADC-D7: U?#1.10(PC0) ; port ADC-D7
ADC-IBG: U6.13(P1-0) ; port ADC-IBG
ADC-ICD: U6.15(P1-2) ; port ADC-ICD
ADC-VBG: U6.14(P1-1) ; port ADC-VBG
ADC-VCD: U6.16(P1-3) ; port ADC-VCD
ANA-IB: U22.2 ; port ANA-IB
ANA-IC: U22.9 ; port ANA-IC
ANA-VB: U22.3 ; port ANA-VB
ANA-VC: U22.10 ; port ANA-VC
BFA: U6.8(P0-4) ; port BFA
IB1: U6.6(P0-2) ; port IB1
IB2: U6.7(P0-3) ; port IB2
IBPOL: U6.9(P0-5) ; port IBPOL
KEEPON: U?#1.30(PE0) ; port KEEPON
KEYINTA: U?#1.5(PB1) ; port KEYINTA
KEYINTB: U?#1.4(PB0) ; port KEYINTB
LCD-D4: U?#1.34(VCC) ; port LCD-D4
LCD-D5: U?#1.35(GND) ; port LCD-D5
LCD-D6: U?#1.36(PF2) ; port LCD-D6
LCD-D7: U?#1.37(PF3) ; port LCD-D7
LCD-E: U?#1.38(PF4) ; port LCD-E
LCD-RS: U?#1.40(PF6) ; port LCD-RS
LCD-RW: U?#1.39(PF5) ; port LCD-RW
MARKER: U?#1.31(PE1) ; port MARKER
MARKERENABLE: U?#1.32(PE2) ; port MARKERENABLE
PMA: U6.4(P0-0) ; port PMA
PMB: U6.5(P0-1) ; port PMB
POWERBUTTON: U?#1.3(PA7) ; port POWERBUTTON
ROTKEY: U?#1.7(PB3) ; port ROTKEY
ROTPHA: U?#1.8(PB4) ; port ROTPHA
ROTPHB: U?#1.9(PB5) ; port ROTPHB
SCL: U6.22(SCL) U?#1.47(PA3) ; port SCL
SDA: U6.23(SDA) U?#1.46(PA2) ; port SDA
SWEEPSTART: U?#1.6(PB2) ; port SWEEPSTART
TRACK: U22.5 U22.6 U22.12 U22.13 U?#1.33(PE3)
UART-RX: U?#3.3(B1)
UART-TX: U?#8.3(B1)
UPDI: R?#1.1 U?#8.1(NO)
VCA: U6.11(P0-7) ; port VCA
VCB: U6.10(P0-6) ; port VCB
NetC41_1: C41.1 U22.1 U?#4.3(+)
NetC43_1: C43.1 U22.4 U?#6.5(+)
NetC45_1: C45.1 U22.8 U?#7.10(+)
NetC46_1: C46.1 U22.11 U?#9.12(+)
NetC?#1_1: C?#1.1 U?#5.4(3V3OUT)
NetD?#1_1: D?#1.1(K) J?.2(DM) U?#5.6(USBDM)
NetD?#1_2: D?#1.2(A) J?.3(DP) U?#5.5(USBDP)
NetR?#1_2: R?#1.2 U?#3.1(NO)
NetR?#2_1: R?#2.1 U?#5.7(~{RESET})
NetR?#3_2: R?#3.2 U?#5.15(TNOW)
NetR?#4_1: R?#4.1 U?#3.6(IN) U?#8.6(IN)
NetU?#1_20: U?#1.20(PD0) U?#4.1(O) U?#4.2(-)
NetU?#1_21: U?#1.21(PD1) U?#6.6(-) U?#6.7(O)
NetU?#1_22: U?#1.22(PD2) U?#7.8(O) U?#7.9(-)
NetU?#1_23: U?#1.23(GND) U?#9.13(-) U?#9.14(O)
NetU?#3_4: U?#3.4(COM) U?#5.2(TXD)
NetU?#5_3: U?#5.3(RXD) U?#8.4(COM)
NetU?#5_9: U?#5.9(~{CTS}) U?#5.14(~{RTS})
NetU?#5_10: U?#5.10(~{DSR}) U?#5.12(~{DCD}) U?#5.13(~{DTR})

Not connected (* = marked no-connect by the designer): J? 1(VCC); R?#3 1; U6 1(~{INT}) 17(P1-4) 18(P1-5) 19(P1-6) 20(P1-7); U?#1 1(PA5) 2(PA6) 14(VDD) 15(GND) 24(PD4) 25(PD5) 26(PD6) 27(PD7) 28(AVDD) 29(GND) 41(UPDI) 42(VDD) 43(GND) 44(AVCC) 45(PA1) 48(PA4); U?#5 11(~{RI})

### Notes on the sheet
- (near U6) 111 = CONTROL BANK
- use processor with UPDI and put a cp2101 on board for programming
- SWITCH TO ATMEGAX64D3
- NEED MORE INTERRUPTS
- mux updi en uart if someone wants to do remote control
- (near U?#3) JUMPER
- (near R?#1) 1K
- (near R?#3) 1K
- (near R?#3) LED TO GND
- UART/UPDI INTERFACE
- (in symbol CAPC-0805-10nF-50V-C0G) 0805
- (in symbol RESC-0603-10K-0.1%-1/10W) 0603

### Library data of the parts
C41 C43 C45 C46 = CAPC-0805-10nF-50V-C0G: CAPACITOR,CERAMIC,10nF,100V,C0G,0805; Manufacturer 1: KEMET; Manufacturer Part Number 1: C0805C103K5GEC7210; Package / Case: 0805 (2012 metric); Location: *; DIGIKEY: 399-C0805C103K5GEC7210CT-ND
C?#1 = CAPC-0603-100nF-50V-X7R: as C1 on sheet FrontPanel; Package / Case: 0603; Location: *; Supplier 1: Mouser; Supplier Part Number 1: 80-C0603C104K5R7867; Supplier 2: Mouser; Supplier Part Number 2: 80-C0603C104K5R7411; Supplier 3: Avnet; Supplier Part Number 3: KGM15BR71H104KT; Supplier 4: Digikey; Supplier Part Number 4: 1276-1000-1-ND; LCSC: C127833; MOUSER: 80-C0603C104K5R
D?#1 = TVS-NEXPERIA-PESD2USB5UX-TR: DIODE,TVS,DUAL,NIDIRETIONAL,USB,PESD2USB5UX-TR,SOT23; DIGIKEY: 1727-PESD2USB5UX-CT-ND; Manufacturer 1: NEXPERIA; Manufacturer Part Number 1: PESD2USB5UX-TR
J? = CONN-CUI-UJ2-BH-BL1-TH: CONN,USB2.0,B,RA,BLUE
R?#1-R?#4 = RESC-0603-10K-0.1%-1/10W: RESISTOR,10K,0.1%,100mW,0603 (1608); Location: *
U6 = IC-NEXPERIA-PCAL9555A: as U1 on sheet FrontPanel; DIGIKEY: 568-9928-1-ND; Manufacturer 1: NEXPERIA
U22 = IC-TI-CD4066-SO14: IC,ANALOG,4XSPST ANALOG SWITCH,NO,TI,CD4016,SO14; Manufacturer Part Number 1: CD4066BM96; DIGIKEY: 296-14475-1-ND; Manufacturer 1: TI
U?#1 = IC-ATMEL-ATMEGA4809-QFP48: IC,CPU,ATMEGA4809,QFP48
U?#2 U?#4 U?#6 U?#7 U?#9 = IC-TI-TL084-SO14: IC,OPAMP JFET,QUAD,TL084HIDR,SO14; Manufacturer 1: TI; Manufacturer Part Number 1: TL082HIDR; MOUSER: 595-TL082HIDR
U?#3 U?#8 = IC-TI-SN74LVC1G3157DBVR: IC,ANALOG,SPDT ANALOG SWITCH,SINGLEGATE,TI,SN74LVC1G3157DBVR,SOT23-6; DIGIKEY: 296-14908-1-ND; Manufacturer 1: TI; Manufacturer Part Number 1: SN74LVC1G3157DBVR
U?#5 = IC-WCH-CH340B: IC,XCVR,USB UART WITH XTAL AND EEPROM,WCH,CH340G-SO16; Manufacturer Part Number 1: FT231XS-R; Manufacturer 1: WCH; MOUSER: CH340B

## Sheet CT8042 Toplevel.SchDoc
size B; SheetNumber: 1; SheetTotal: 9
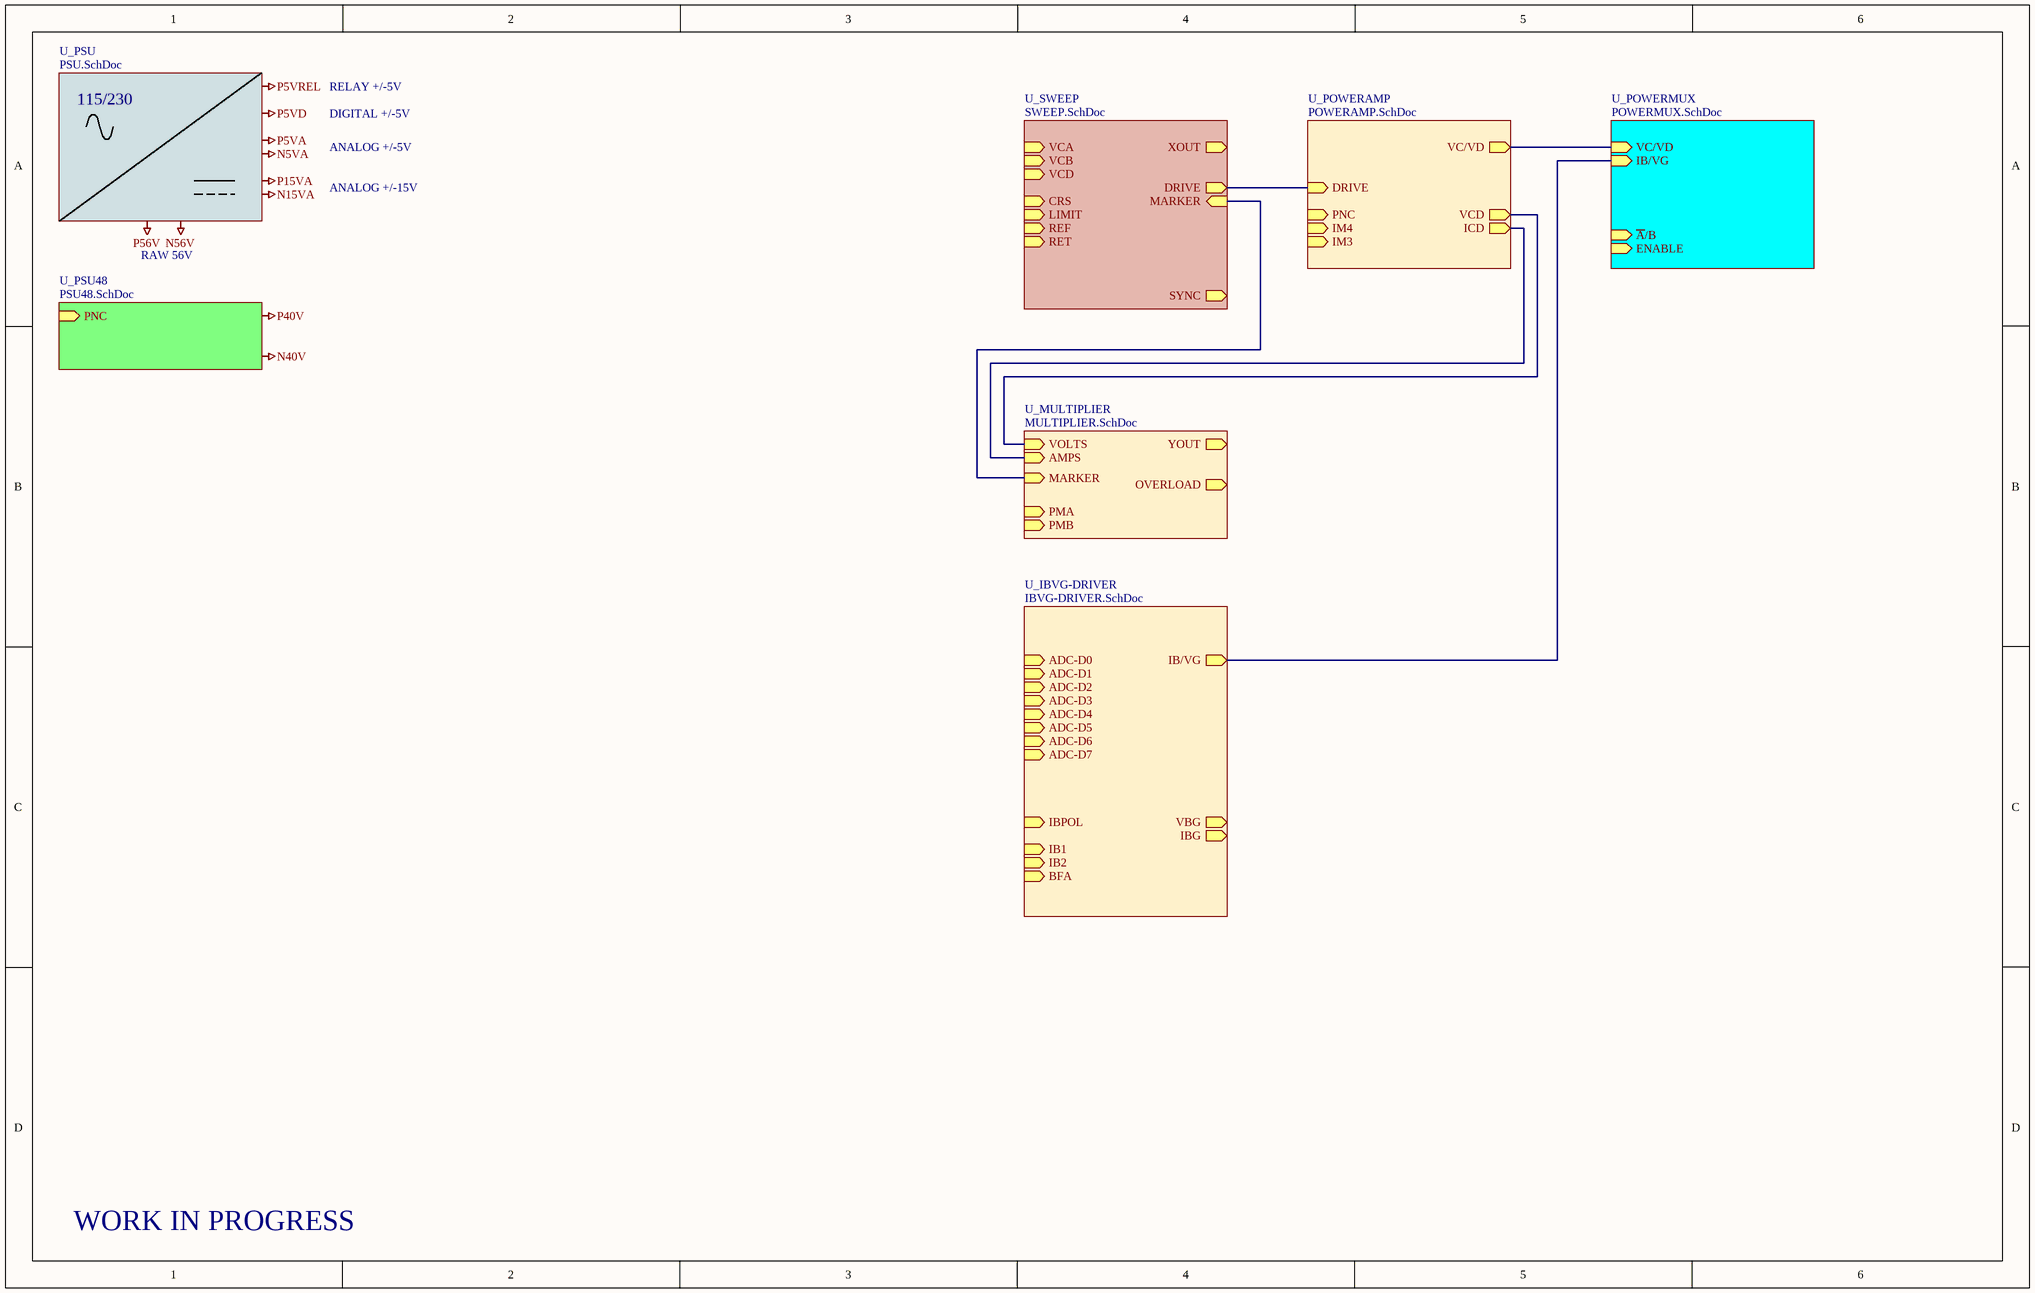
[diagram p3: CT8042 Toplevel.SchDoc]

### Sub-sheets
U_IBVG-DRIVER = IBVG-DRIVER.SchDoc: BFA (in), IB2 (in), IB1 (in), ADC-D0 (in), ADC-D1 (in), ADC-D2 (in), ADC-D3 (in), ADC-D4 (in), ADC-D5 (in), ADC-D6 (in), ADC-D7 (in), VBG (out), IBG (out), IBPOL (in), IB/VG (out)
U_MULTIPLIER = MULTIPLIER.SchDoc: PMA (in), PMB (in), OVERLOAD (out), VOLTS (in), AMPS (in), MARKER (in), YOUT (out)
U_POWERAMP = POWERAMP.SchDoc: VC/VD (out), ICD (out), PNC (in), DRIVE (in), IM3 (in), IM4 (in), VCD (out)
U_POWERMUX = POWERMUX.SchDoc: VC/VD (in), IB/VG (in), ~{A}/B (in), ENABLE (in)
U_PSU = PSU.SchDoc: no entries
U_PSU48 = PSU48.SchDoc: PNC (in)
U_SWEEP = SWEEP.SchDoc: RET (in), DRIVE (out), REF (in), SYNC (out), LIMIT (in), CRS (in), MARKER (in), XOUT (out), VCD (in), VCA (in), VCB (in)

### Nets
DRIVE: sheet U_POWERAMP/DRIVE, sheet U_SWEEP/DRIVE
IB/VG: sheet U_IBVG-DRIVER/IB/VG, sheet U_POWERMUX/IB/VG
MARKER: sheet U_SWEEP/MARKER, sheet U_MULTIPLIER/MARKER
VC/VD: sheet U_POWERAMP/VC/VD, sheet U_POWERMUX/VC/VD
VCD: sheet U_POWERAMP/VCD, sheet U_MULTIPLIER/VOLTS
(unnamed): sheet U_POWERAMP/ICD, sheet U_MULTIPLIER/AMPS

### Notes on the sheet
- 115/230
- RELAY +/-5V
- ANALOG +/-5V
- DIGITAL +/-5V
- ANALOG +/-15V
- RAW 56V
- WORK IN PROGRESS
- Labels drawn without touching a wire or pin: N5VA, N15VA, N40V, N56V, P5VA, P5VD, P5VREL, P15VA, P40V, P56V

## Sheet PSU.SchDoc
size Tabloid; SheetNumber: 9; SheetTotal: 9
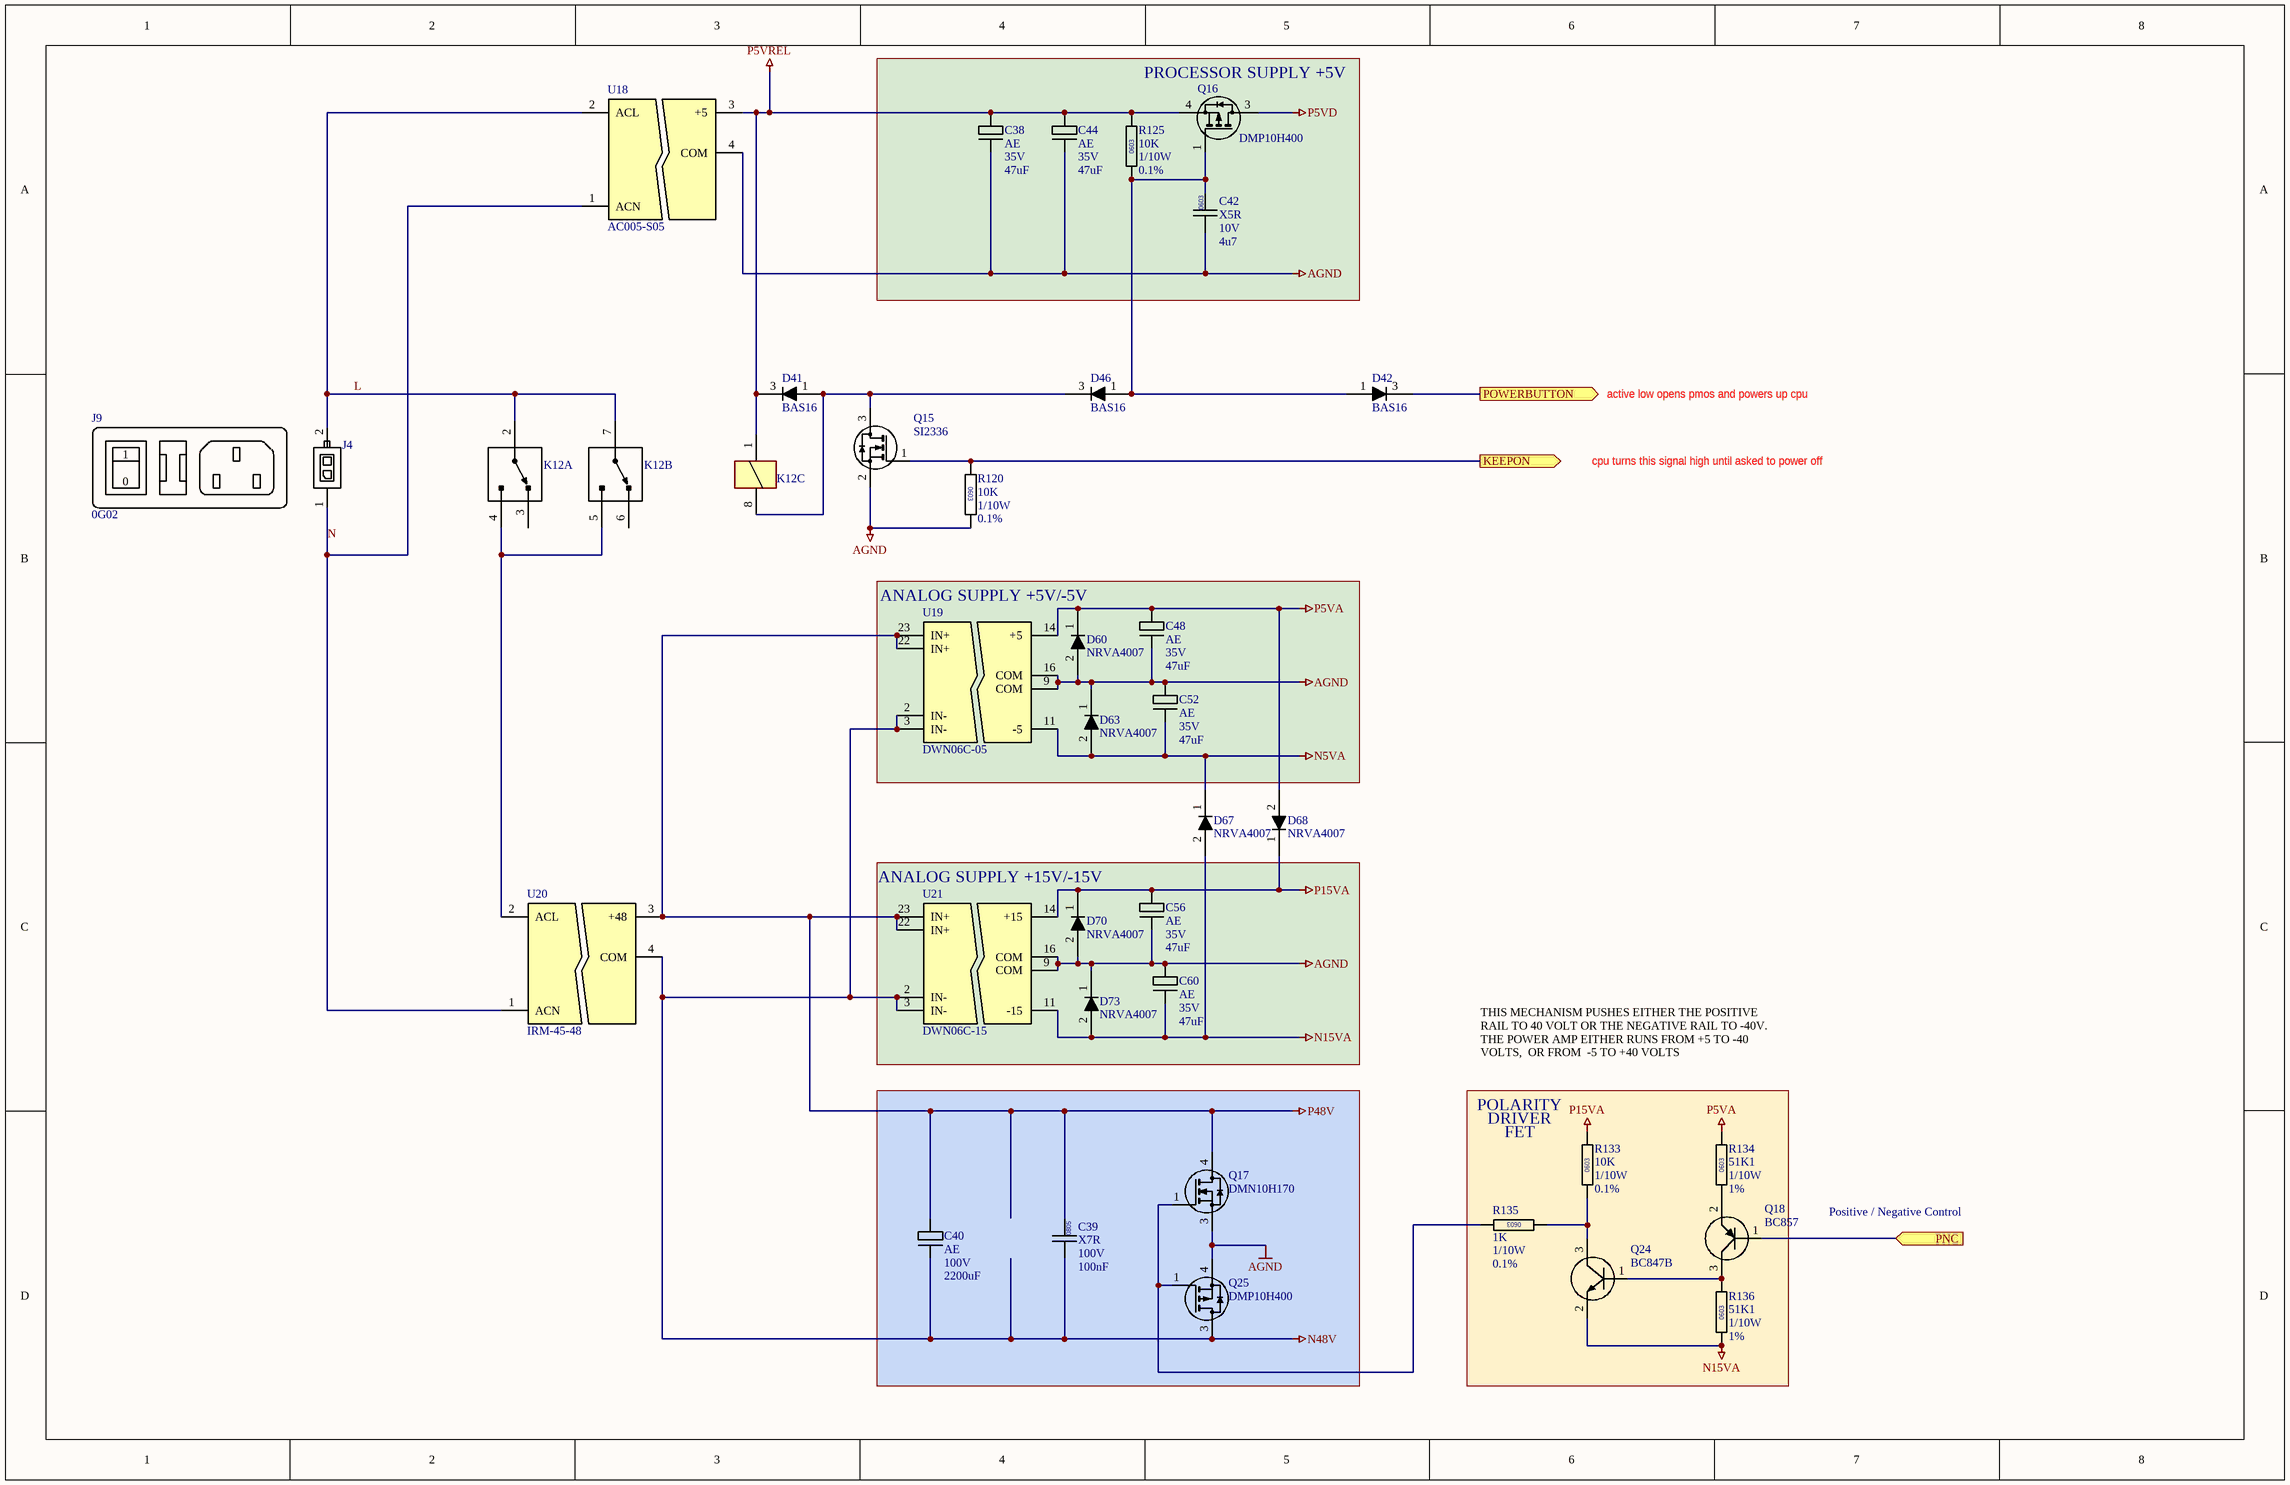
[diagram p4: PSU.SchDoc]

### Parts
(Parts that share a designator on the sheet are numbered #1, #2 ... from top to bottom, then left to right.)
C38  Dielectric: AE  Voltage: 35V  Capacitance: 47uF  [CAPAE-KEMET-ESW476M035AE3AA]  (hidden comment: CAP0603)
C39  Dielectric: X7R  Voltage: 100V  Capacitance: 100nF  [CAPC0805]  (hidden comment: CAP0805)
C40  Dielectric: AE  Voltage: 100V  Capacitance: 2200uF  [CAPAE-NICHICON-LGY2A222MELC30]  (hidden comment: CAP0603)
C42  Dielectric: X5R  Voltage: 10V  Capacitance: 4u7  [CAPC0603]  (hidden comment: CAP0603)
C44  Dielectric: AE  Voltage: 35V  Capacitance: 47uF  [CAPAE-KEMET-ESW476M035AE3AA]  (hidden comment: CAP0603)
C48  Dielectric: AE  Voltage: 35V  Capacitance: 47uF  [CAPAE-KEMET-ESW476M035AE3AA]  (hidden comment: CAP0603)
C52  Dielectric: AE  Voltage: 35V  Capacitance: 47uF  [CAPAE-KEMET-ESW476M035AE3AA]  (hidden comment: CAP0603)
C56  Dielectric: AE  Voltage: 35V  Capacitance: 47uF  [CAPAE-KEMET-ESW476M035AE3AA]  (hidden comment: CAP0603)
C60  Dielectric: AE  Voltage: 35V  Capacitance: 47uF  [CAPAE-KEMET-ESW476M035AE3AA]  (hidden comment: CAP0603)
D41  BAS16  [SOT23]
D42  BAS16  [SOT23]
D46  BAS16  [SOT23]
D60  NRVA4007  [DO214AC]
D63  NRVA4007  [DO214AC]
D67  NRVA4007  [DO214AC]
D68  NRVA4007  [DO214AC]
D70  NRVA4007  [DO214AC]
D73  NRVA4007  [DO214AC]
J4  CONNECTOR-MOLEX-43045-0202  [CONN-MOLEX-430450214]  (value not drawn)
J9  0G02  (mechanical)
K12  RELAY-CIT-J104B2C5VDC.20S  [RELAY-CIT-J104B2C5VDC.20S]  (value not drawn)  (parts A,B,C of 3)
Q15#1  SI2336  [SOT23]
Q16#1  DMP10H400  [DPAK]
Q17#1  DMN10H170  [DPAK]
Q18#1  BC857  [SOT23]
Q24  BC847B  [SOT23]
Q25  DMP10H400  [DPAK]
R120  value 10K  Power: 1/10W  Tolerance: 0.1%  [RESC0603]  (hidden comment: RESC0603)
R125  value 10K  Power: 1/10W  Tolerance: 0.1%  [RESC0603]  (hidden comment: RESC0603)
R133#1  value 10K  Power: 1/10W  Tolerance: 0.1%  [RESC0603]  (hidden comment: RESC0603)
R134#1  value 51K1  Power: 1/10W  Tolerance: 1%  [RESC0603]  (hidden comment: RESC0603)
R135#1  value 1K  Power: 1/10W  Tolerance: 0.1%  [RESC0603]  (hidden comment: RESC0603)
R136#1  value 51K1  Power: 1/10W  Tolerance: 1%  [RESC0603]  (hidden comment: RESC0603)
U18  AC005-S05  [MODULE-ADAMTECH-AC005-S05]
U19  DWN06C-05  [MODULE-MEANWELL-DCWN06C]
U20  IRM-45-48  [MODULE-MEANWELL-IRM-45-48]
U21  DWN06C-15  [MODULE-MEANWELL-DCWN06C]

### Blocks framed on the sheet
PROCESSOR SUPPLY +5V: C38 C42 C44 Q16#1 R125
ANALOG SUPPLY +5V/-5V: C48 C52 D60 D63 U19
ANALOG SUPPLY +15V/-15V: C56 C60 D70 D73 U21

### Ports
KEEPON (out), PNC (in), POWERBUTTON (out)

### Nets
AGND: C38.2 C42.2 C44.2 C48.2 C52.1 C56.2 C60.1 D60.2(A) D63.1(K) D70.2(A) D73.1(K) Q15#1.2(S) Q17#1.3(S) Q25.4(S) R120.1 U18.4(COM) U19.9(COM) U19.16(COM) U21.9(COM) U21.16(COM)
N5VA: C52.2 D63.2(A) D67.1(K) U19.11(-5)
N15VA: C60.2 D67.2(A) D73.2(A) Q24.2(E) R136#1.2 U21.11(-15)
N48V: C39.2 C40.2 Q25.3(D) U19.2(IN-) U19.3(IN-) U20.4(COM) U21.2(IN-) U21.3(IN-)  [project net N56V]
P5VA: C48.1 D60.1(K) D68.2(A) R134#1.1 U19.14(+5)
P5VD: Q16#1.3(D)
P5VREL: C38.1 C44.1 D41.3(K) K12.1 Q16#1.4(S) R125.1 U18.3(+5)
P15VA: C56.1 D68.1(K) D70.1(K) R133#1.1 U21.14(+15)
P48V: C39.1 C40.1 Q17#1.4(D) U19.22(IN+) U19.23(IN+) U20.3(+48) U21.22(IN+) U21.23(IN+)
KEEPON: Q15#1.1(G1) R120.2 ; port KEEPON
L: J4.2 K12.2(NC) K12.7(NC) U18.2(ACL)
N: J4.1 U18.1(ACN) U20.1(ACN)
PNC: Q18#1.1(B) ; port PNC
POWERBUTTON: D42.3(K) ; port POWERBUTTON
NetC42_1: C42.1 D42.1(A) D46.1(A) Q16#1.1(G1) R125.2
NetD41_1: D41.1(A) D46.3(K) K12.8 Q15#1.3(D)
NetK12_4: K12.4(NO) K12.5(NO) U20.2(ACL)
NetQ17#1_1: Q17#1.1(G1) Q25.1(G1) R135#1.2
NetQ18#1_2: Q18#1.2(E) R134#1.2
NetQ18#1_3: Q18#1.3(C) Q24.1(B) R136#1.1
NetQ24_3: Q24.3(C) R133#1.2 R135#1.1

Not connected (* = marked no-connect by the designer): K12 3(COM) 6(COM)

### Notes on the sheet
- active low opens pmos and powers up cpu
- cpu turns this signal high until asked to power off
- THIS MECHANISM PUSHES EITHER THE POSITIVE RAIL TO 40 VOLT OR THE NEGATIVE RAIL TO -40V.
  THE POWER AMP EITHER RUNS FROM +5 TO -40 VOLTS,  OR FROM  -5 TO +40 VOLTS
- (near R133#1) POLARITY
- (near R133#1) DRIVER
- FET
- Positive / Negative Control
- (in symbol CAPC-0805-100nF-100V) 0805
- (in symbol CONN-DELTA-0G02) 1; 0
- (in symbol RESC-0603-1K-0.1%-1/10W) 0603
- (in symbol RESC-0603-10K-0.1%-1/10W) 0603
- (in symbol RESC-0603-51K1-1%-1/10W) 0603

### Library data of the parts
C38 C44 C48 C52 C56 C60 = CAPP-AE-47uF-35V-TH025P063D125H: CAPACITOR,ALU,47uF,35V,TH,P0.25mm,D6.3mm,H12.5mm; Manufacturer 1: KEMET; Manufacturer Part Number 1: ESW476M035AE3AA; Location: *
C39 = CAPC-0805-100nF-100V: CAPACITOR,CERAMIC,100nF,100V,X7R,0805; Package / Case: 0805 (2012 metric); Location: *
C40 = CAPP-AE-2200uF-100V-TH100P350D320H: CAPACITOR,ALU,2200uF,100V,TH,P10mm,D35mm,H32mm,SNAP; Manufacturer 1: NICHICON; Manufacturer Part Number 1: LGY2A222MELC30; Location: *
C42 = CAPC-0603-4u7-10V-X5R: CAPACITOR,CERAMIC,4u7,10V,X5R,0603; Manufacturer 1: SAMSUNG; Manufacturer Part Number 1: CL10A475KP8NNNC; Package / Case: 0603; Location: *; Supplier 1: Arrow Electronics; Supplier Part Number 1: GRM188Z71A475KE15J; LCSC: C1705; MOUSER: 187-CL10A475KP8NNNC
D41 D42 D46 = DIODE-RECTIFIER-DIODES-BAS16-SOT23: DIODE,RECTIFIER,75V,0.3A,BAS16,SOT23; Manufacturer 1: ONSEMI; Manufacturer Part Number 1: BAS16LT1G; DIGIKEY: BAS16LT1GOSCT-ND
D60 D63 D67 D68 D70 D73 = DIODE-ONSEMI-NRVA4007T3G: DIODE,RECTIFIER,1000V,1A,ONSEMI,NRVA4007,SMA; DIGIKEY: NRVA4007T3GOSCT-ND; Manufacturer 1: ONSEMI; Manufacturer Part Number 1: NRVA4007T3G
J4 = CONN-MOLEX-430450214: CONN,1X2,MOLEX, MICROFIT,VERT
J9 = CONN-DELTA-0G02: CONN,POWER,IEC,SWITCH,FUSE ASSEMBLY,PANELMOUNT
K12 = RELAY-CIT-J104B2C5VDC.20S: RELAY,DPDT,5V COIL,250VAC,3A; Manufacturer 1: CIT; DIGIKEY: 2449-J104B2C5VDC.20S-ND; Manufacturer Part Number 1: J104B2C5VDC.20S
Q15#1 = XSTR-NMOS-VISHAY-SI2336DS-T1-BE3: XSTR,NMOS,30V,4.3A,SI2336DS-T1-BE3.SOT23; Manufacturer 1: VISHAY; Package: SOT23; Vds: 30V; Idmax: 4.3A; DIGIKEY: 742-SI2336DS-T1-BE3CT-ND; Manufacturer Part Number 1: SI2336DS-T1-BE3
Q16#1 Q25 = XSTR-PMOS-DIODES-DMP10H400SK3-13: XSTR,PMOS,100V,5.6A,DMP10H400SK3-13,DPAK; Manufacturer 1: DIODES; Idmax: 9A; Package: DPAK; Vds: 100V; Manufacturer Part Number 1: DMP10H400SK3-13
Q17#1 = XSTR-NMOS-DIODES-DMN10H170SK3-13: XSTR,NMOS,100V,12A,DMN10H170SK3-13,DPAK; Manufacturer 1: DIODES; Idmax: 5.6; Package: DPAK; Vds: 100V; Manufacturer Part Number 1: DMN10H170SK3-13
Q18#1 = XSTR-PNP-BC857: XSTR,PNP,SOT23,BC857,SOT23
Q24 = XSTR-NPN-BC847: XSTR,NPN,45V,0.1A,,BC847B,SOT23
R120 R125 R133#1 = RESC-0603-10K-0.1%-1/10W: RESISTOR,10K,0.1%,100mW,0603 (1608); Location: *
R134#1 R136#1 = RESC-0603-51K1-1%-1/10W: RESISTOR,51K1,1%,100mW,0603 (1608); Location: *
R135#1 = RESC-0603-1K-0.1%-1/10W: RESISTOR,1K,0.1%,100mW,0603 (1608); Location: *
U18 = MODULE-ADAMTECH-AC005-S05: MOD,AC/DC,ISO,90...264 AC,+5V OUT,1A
U19 = MODULE-MEANWELL-DWN06C-05: MOD,DC/DC,ISO,DC 36...72V IN,+/-5V OUT,1A
U20 = MODULE-MEANWELL-IRM-45-48: MOD,AC/DC,ISO,90...264 AC,+48V OUT,1A
U21 = MODULE-MEANWELL-DWN06C-15: MOD,DC/DC,ISO,DC 36...72V IN,+/-15V OUT,200mA

## Sheet POWERAMP.SchDoc
size Tabloid; SheetNumber: 6; SheetTotal: 9
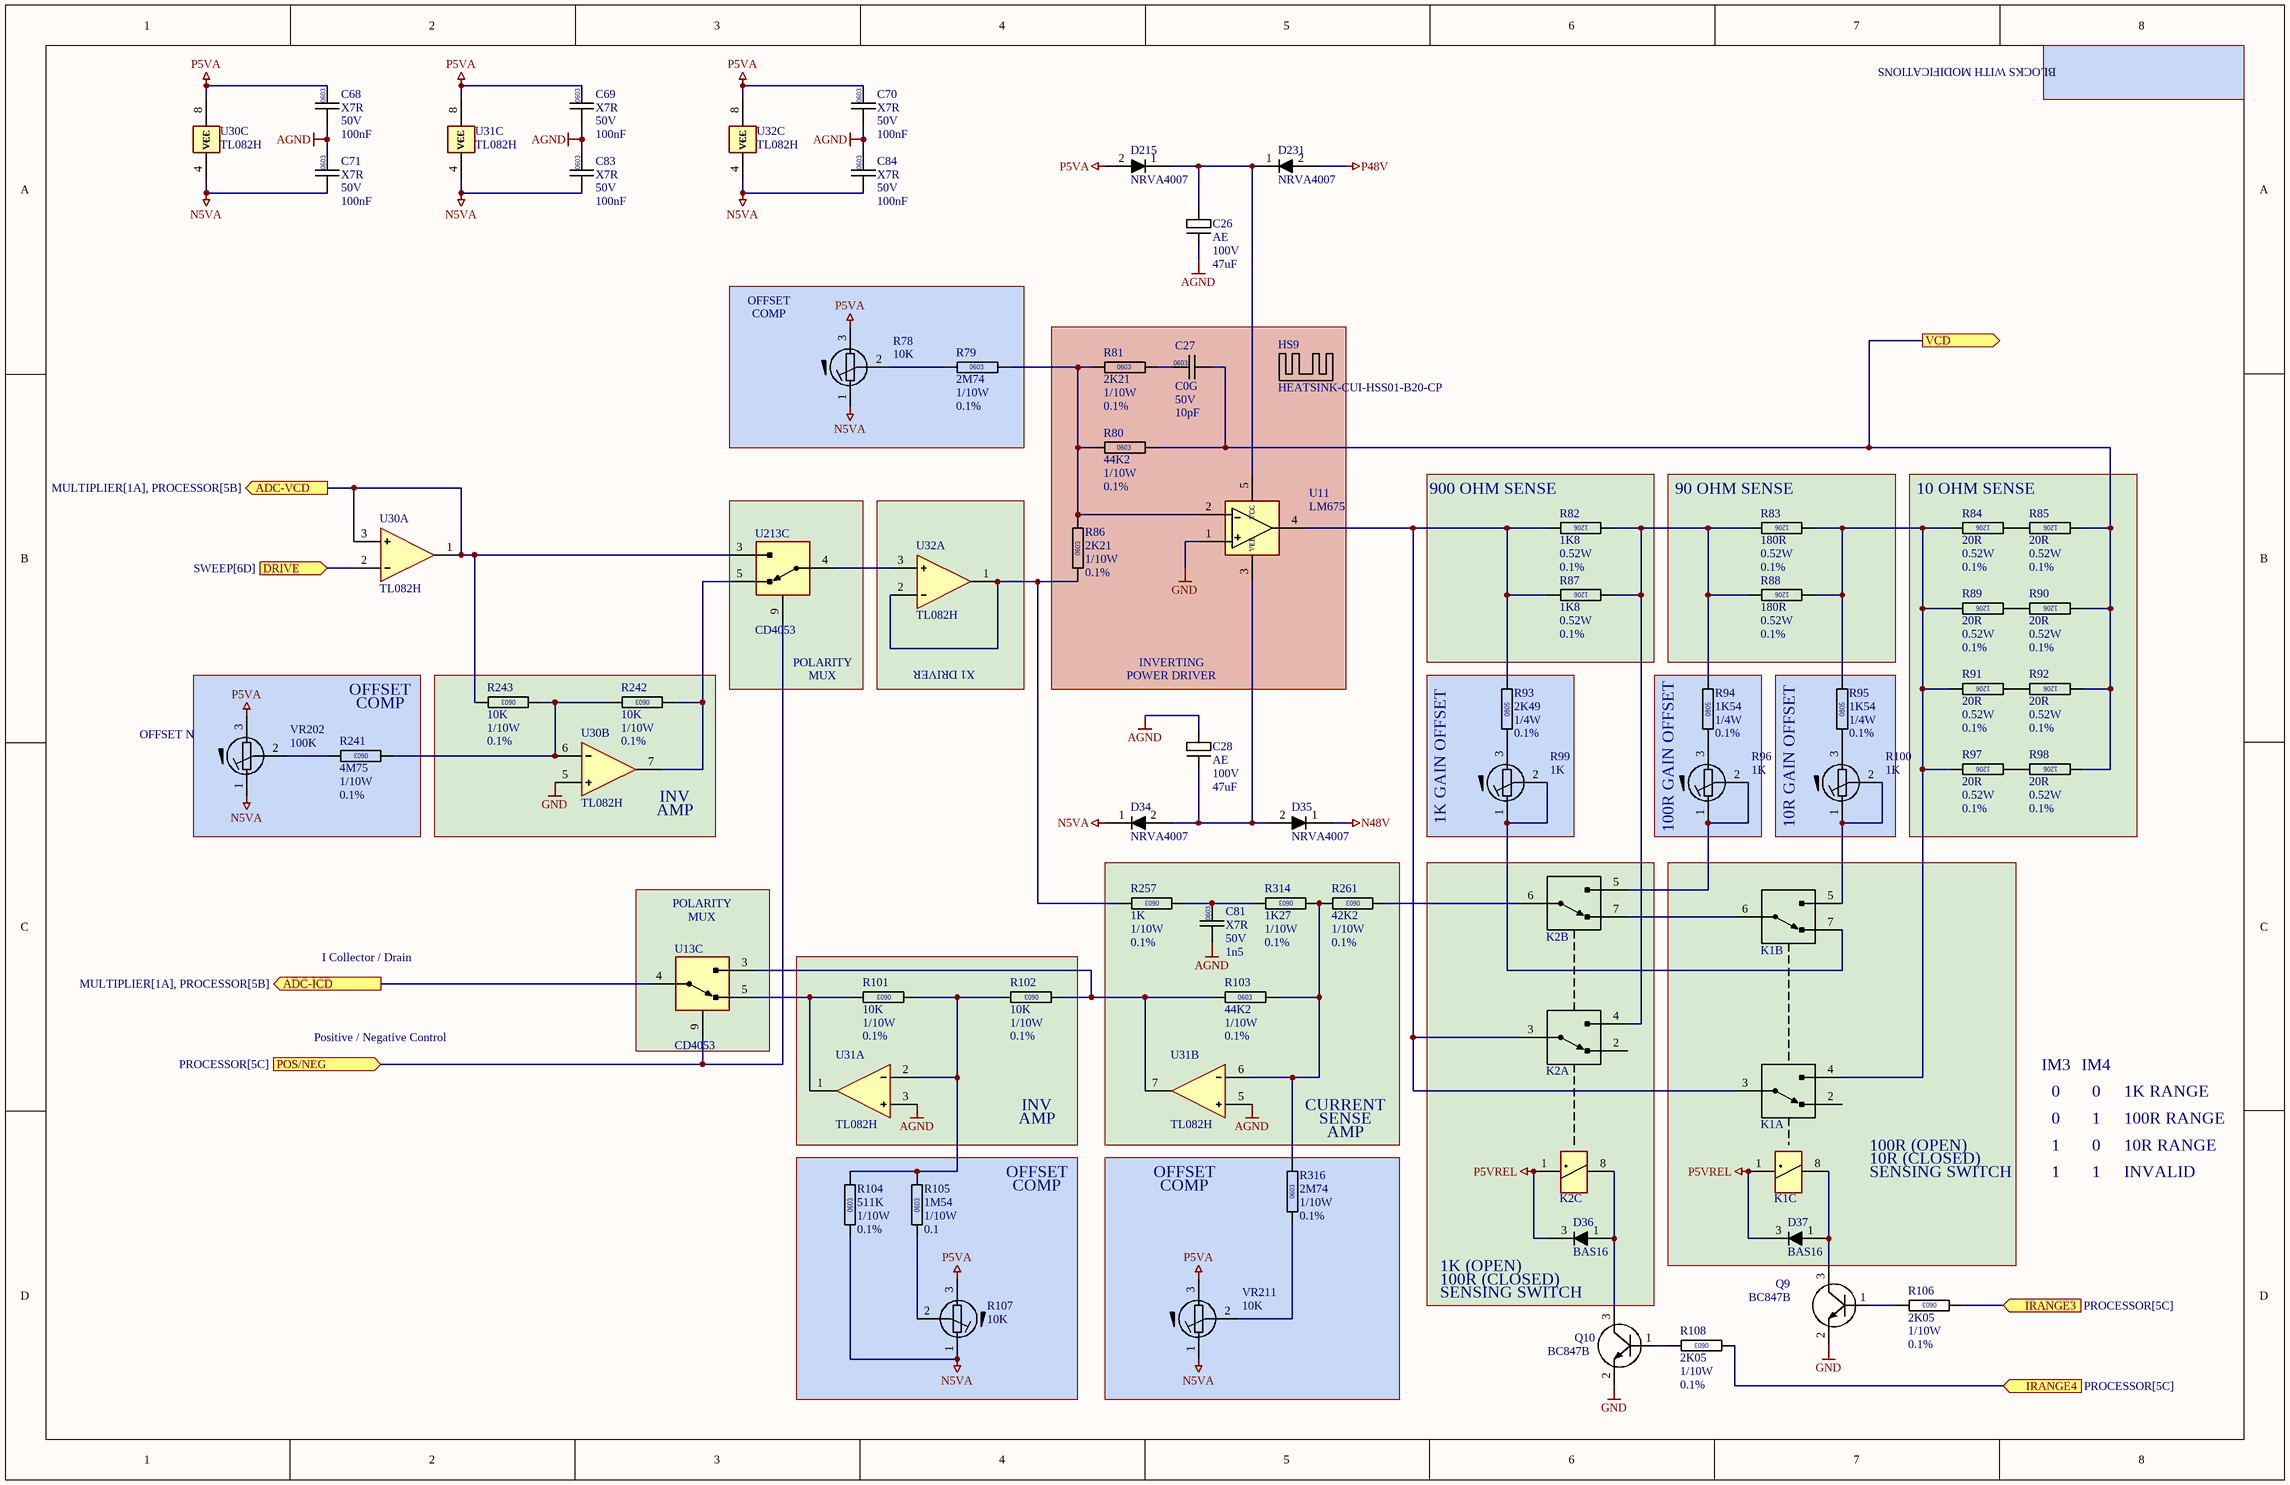
[diagram p5: POWERAMP.SchDoc]

### Parts
C26  Dielectric: AE  Voltage: 100V  Capacitance: 47uF  [CAPAE-KEMET-ESL476M100AH9AA]  (hidden comment: CAP0603)
C27  Dielectric: C0G  Voltage: 50V  Capacitance: 10pF  [CAPC0603]  (hidden comment: CAP0603)
C28  Dielectric: AE  Voltage: 100V  Capacitance: 47uF  [CAPAE-KEMET-ESL476M100AH9AA]  (hidden comment: CAP0603)
C68  Dielectric: X7R  Voltage: 50V  Capacitance: 100nF  [CAPC0603]  (hidden comment: CAP0603)
C69  Dielectric: X7R  Voltage: 50V  Capacitance: 100nF  [CAPC0603]  (hidden comment: CAP0603)
C70  Dielectric: X7R  Voltage: 50V  Capacitance: 100nF  [CAPC0603]  (hidden comment: CAP0603)
C71  Dielectric: X7R  Voltage: 50V  Capacitance: 100nF  [CAPC0603]  (hidden comment: CAP0603)
C81  Dielectric: X7R  Voltage: 50V  Capacitance: 1n5  [CAPC0603]  (hidden comment: CAP0603)
C83  Dielectric: X7R  Voltage: 50V  Capacitance: 100nF  [CAPC0603]  (hidden comment: CAP0603)
C84  Dielectric: X7R  Voltage: 50V  Capacitance: 100nF  [CAPC0603]  (hidden comment: CAP0603)
D34  NRVA4007  [DO214AC]
D35  NRVA4007  [DO214AC]
D36  BAS16  [SOT23]
D37  BAS16  [SOT23]
D215  NRVA4007  [DO214AC]
D231  NRVA4007  [DO214AC]
HS9  HEATSINK-CUI-HSS01-B20-CP  [HEATSINK-CUI-HSS01-B20-CP]
K1  RELAY-KEMET-UA2-5NJ  [RELAY-KEMET-UA2-5NJ]  (value not drawn)  (parts A,B,C of 3)
K2  RELAY-KEMET-UA2-5NJ  [RELAY-KEMET-UA2-5NJ]  (value not drawn)  (parts A,B,C of 3)
Q9  BC847B  [SOT23]
Q10  BC847B  [SOT23]
R78  value 10K  [TRIMMER-BOURNS-3214X]  (hidden comment: TRIMMER-BOURNS-3214X-1-103E)
R79  value 2M74  Power: 1/10W  Tolerance: 0.1%  [RESC0603]  (hidden comment: RESC0603)
R80  value 44K2  Power: 1/10W  Tolerance: 0.1%  [RESC0603]  (hidden comment: RESC0603)
R81  value 2K21  Power: 1/10W  Tolerance: 0.1%  [RESC0603]  (hidden comment: RESC0603)
R82  value 1K8  Power: 0.52W  Tolerance: 0.1%  [RESC1206]  (hidden comment: RESC1206)
R83  value 180R  Power: 0.52W  Tolerance: 0.1%  [RESC1206]  (hidden comment: RESC1206)
R84  value 20R  Power: 0.52W  Tolerance: 0.1%  [RESC1206]  (hidden comment: RESC1206)
R85  value 20R  Power: 0.52W  Tolerance: 0.1%  [RESC1206]  (hidden comment: RESC1206)
R86  value 2K21  Power: 1/10W  Tolerance: 0.1%  [RESC0603]  (hidden comment: RESC0603)
R87  value 1K8  Power: 0.52W  Tolerance: 0.1%  [RESC1206]  (hidden comment: RESC1206)
R88  value 180R  Power: 0.52W  Tolerance: 0.1%  [RESC1206]  (hidden comment: RESC1206)
R89  value 20R  Power: 0.52W  Tolerance: 0.1%  [RESC1206]  (hidden comment: RESC1206)
R90  value 20R  Power: 0.52W  Tolerance: 0.1%  [RESC1206]  (hidden comment: RESC1206)
R91  value 20R  Power: 0.52W  Tolerance: 0.1%  [RESC1206]  (hidden comment: RESC1206)
R92  value 20R  Power: 0.52W  Tolerance: 0.1%  [RESC1206]  (hidden comment: RESC1206)
R93  value 2K49  Power: 1/4W  Tolerance: 0.1%  [RESC0805]  (hidden comment: RESC0805)
R94  value 1K54  Power: 1/4W  Tolerance: 0.1%  [RESC0805]  (hidden comment: RESC0805)
R95  value 1K54  Power: 1/4W  Tolerance: 0.1%  [RESC0805]  (hidden comment: RESC0805)
R96  value 1K  [TRIMMER-BOURNS-3214X]  (hidden comment: TRIMMER-BOURNS-3214X-1-102E)
R97  value 20R  Power: 0.52W  Tolerance: 0.1%  [RESC1206]  (hidden comment: RESC1206)
R98  value 20R  Power: 0.52W  Tolerance: 0.1%  [RESC1206]  (hidden comment: RESC1206)
R99  value 1K  [TRIMMER-BOURNS-3214X]  (hidden comment: TRIMMER-BOURNS-3214X-1-102E)
R100  value 1K  [TRIMMER-BOURNS-3214X]  (hidden comment: TRIMMER-BOURNS-3214X-1-102E)
R101  value 10K  Power: 1/10W  Tolerance: 0.1%  [RESC0603]  (hidden comment: RESC0603)
R102  value 10K  Power: 1/10W  Tolerance: 0.1%  [RESC0603]  (hidden comment: RESC0603)
R103  value 44K2  Power: 1/10W  Tolerance: 0.1%  [RESC0603]  (hidden comment: RESC0603)
R104  value 511K  Power: 1/10W  Tolerance: 0.1%  [RESC0603]  (hidden comment: RESC0603)
R105  value 1M54  Power: 1/10W  Tolerance: 0.1  [RESC0603]  (hidden comment: RESC0603)
R106  value 2K05  Power: 1/10W  Tolerance: 0.1%  [RESC0603]  (hidden comment: RESC0603)
R107  value 10K  [TRIMMER-BOURNS-3214X]  (hidden comment: TRIMMER-BOURNS-3214X-1-103E)
R108  value 2K05  Power: 1/10W  Tolerance: 0.1%  [RESC0603]  (hidden comment: RESC0603)
R241  value 4M75  Power: 1/10W  Tolerance: 0.1%  [RESC0603]  (hidden comment: RESC0603)
R242  value 10K  Power: 1/10W  Tolerance: 0.1%  [RESC0603]  (hidden comment: RESC0603)
R243  value 10K  Power: 1/10W  Tolerance: 0.1%  [RESC0603]  (hidden comment: RESC0603)
R257  value 1K  Power: 1/10W  Tolerance: 0.1%  [RESC0603]  (hidden comment: RESC0603)
R261  value 42K2  Power: 1/10W  Tolerance: 0.1%  [RESC0603]  (hidden comment: RESC0603)
R314  value 1K27  Power: 1/10W  Tolerance: 0.1%  [RESC0603]  (hidden comment: RESC0603)
R316  value 2M74  Power: 1/10W  Tolerance: 0.1%  [RESC0603]  (hidden comment: RESC0603)
U11  LM675  [TO220-5-V]
U13  CD4053  [SO127P600-16N]  (part C of 4)
U30  TL082H  [SO127P600-8N]  (parts A,B,C of 3)
U31  TL082H  [SO127P600-8N]  (parts A,B,C of 3)
U32  TL082H  [SO127P600-8N]  (parts A,C of 3)
U213  CD4053  [SO127P600-16N]  (part C of 4)
VR202  value 100K  [TRIMMER-BOURNS-3214X]  (hidden comment: TRIMMER-BOURNS-3214X-1-104)
VR211  value 10K  [TRIMMER-BOURNS-3214X]  (hidden comment: TRIMMER-BOURNS-3214X-1-103E)

### Blocks framed on the sheet
900 OHM SENSE: R82 R87
90 OHM SENSE: R83 R88
10 OHM SENSE: R84 R85 R89-R92 R97 R98
X1 DRIVER: U32
1K GAIN OFFSET: R93 R99
100R GAIN OFFSET: R94 R96
10R GAIN OFFSET: R95 R100

### Ports
ADC-ICD (out, see MULTIPLIER[1A], PROCESSOR[5B]), ADC-VCD (out, see MULTIPLIER[1A], PROCESSOR[5B]), DRIVE (in, see SWEEP[6D]), IRANGE3 (in, see PROCESSOR[5C]), IRANGE4 (in, see PROCESSOR[5C]), POS/NEG (in, see PROCESSOR[5C]), VCD (out)

### Nets
AGND: C26.2 C28.1 C68.2 C69.2 C70.2 C71.1 C81.2 C83.1 C84.1 U31.3(+) U31.5(+)
GND: Q9.2(E) Q10.2(E) U11.1(+) U30.5(+)
N5VA: C71.2 C83.2 C84.2 D34.1(K) R78.1 R104.2 R107.1 U30.4(VEE) U31.4(VEE) U32.4(VEE) VR202.1 VR211.1
N48V: D35.1(K)  [project net N56V]
P5VA: C68.1 C69.1 C70.1 D215.2(A) R78.3 R107.3 U30.8(VCC) U31.8(VCC) U32.8(VCC) VR202.3 VR211.3
P5VREL: D36.3(K) D37.3(K) K1.1 K2.1
P48V: D231.2(A)
ADC-ICD: U13.4(Y3) ; port ADC-ICD
ADC-VCD: R243.1 U30.1(O) U30.3(+) U213.3(Y) ; port ADC-VCD
DRIVE: U30.2(-) ; port DRIVE
IRANGE3: R106.1 ; port IRANGE3
IRANGE4: R108.1 ; port IRANGE4
POS/NEG: U13.9(B) U213.9(B) ; port POS/NEG
VCD: C27.2 R80.2 R85.2 R90.2 R92.2 R98.2 ; port VCD
NetC26_1: C26.1 D215.1(K) D231.1(K) U11.5(VCC)
NetC27_1: C27.1 R81.2
NetC28_2: C28.2 D34.2(A) D35.2(A) U11.3(VEE)
NetC81_1: C81.1 R257.2 R314.1
NetD36_1: D36.1(A) K2.8 Q10.3(C)
NetD37_1: D37.1(A) K1.8 Q9.3(C)
NetK1_3: K1.3(COM) K2.3(COM) R82.1 R87.1 R93.1 U11.4(OUT)
NetK1_4: K1.4(NO) R83.2 R84.1 R88.2 R89.1 R91.1 R95.2 R97.1
NetK1_5: K1.5(NO) R100.1 R100.2
NetK1_6: K1.6(COM) K2.7(NC)
NetK1_7: K1.7(NC) R99.1 R99.2
NetK2_4: K2.4(NO) R82.2 R83.1 R87.2 R88.1 R94.2
NetK2_5: K2.5(NO) R96.1 R96.2
NetK2_6: K2.6(COM) R261.2
NetQ9_1: Q9.1(B) R106.2
NetQ10_1: Q10.1(B) R108.2
NetR78_2: R78.2 R79.1
NetR79_2: R79.2 R80.1 R81.1 R86.2 U11.2(-)
NetR84_2: R84.2 R85.1
NetR86_1: R86.1 R257.1 U32.1(O) U32.2(-)
NetR89_2: R89.2 R90.1
NetR91_2: R91.2 R92.1
NetR93_2: R93.2 R99.3
NetR94_1: R94.1 R96.3
NetR95_1: R95.1 R100.3
NetR97_2: R97.2 R98.1
NetR101_1: R101.1 U13.5(Y1) U31.1(O)
NetR101_2: R101.2 R102.1 R104.1 R105.1 U31.2(-)
NetR102_2: R102.2 R103.1 U13.3(Y) U31.7(O)
NetR103_2: R103.2 R261.1 R314.2 R316.2 U31.6(-)
NetR105_2: R105.2 R107.2
NetR241_1: R241.1 VR202.2
NetR241_2: R241.2 R242.1 R243.2 U30.6(-)
NetR242_2: R242.2 U30.7(O) U213.5(Y1)
NetR316_1: R316.1 VR211.2
NetU32_3: U32.3(+) U213.4(Y3)

Not connected (* = marked no-connect by the designer): K1 2(NC); K2 2(NC)

### Notes on the sheet
- BLOCKS WITH MODIFICATIONS
- OFFSET
- COMP
- (near R241) COMP
- POLARITY
- MUX
- POWER DRIVER
- INVERTING
- OFFSET N
- (near U30) INV
- (near U30) AMP
- I Collector / Drain
- (near U13) MUX
- Positive / Negative Control
- INV
- CURRENT
- IM3
- 0
- IM4
- 1K RANGE
- AMP
- SENSE
- (near R316) AMP
- 100R (OPEN)
- SENSING SWITCH
- 10R (CLOSED)
- 1
- INVALID
- 100R RANGE
- 10R RANGE
- 1K (OPEN)
- (near D36) 100R (CLOSED)
- DWG. NO.
- REV.
- SHT.
- THIS DOCUMENT AND THE DATA DISCLOSED HEREIN OR HEREWITH IS THE PROPERTY OF ALTIUM LIMITED AND MAY BE FREELY DISTRIBUTED IN WHOLE. NO RIGHTS ARE RESERVED OR EXPRESS OR IMPLIED WARANTEE GIVEN.
- REVISION
- DESCRIPTION
- DATE
- APPROVED
- ENG:
- APPROVALS
- PROJECT
- DSN:
- CHK:
- REFERENCE DOCUMENTS
- PROJECT REVISION:
- TITLE
- DOCUMENT REVISION:
- DESIGN ITEM:
- BOM:
- FAB DWG:
- PCB DWG:
- ASSY DWG:
- SCALE:
- SIZE
- B
- CAGE CODE
- FILE NAME
- DWG NO.
- SHEET
- OF
- REV
- (in symbol RESC-0603-1K27-0.1%-1/10W) 0603
- (in symbol RESC-0603-1K-0.1%-1/10W) 0603
- (in symbol RESC-0603-1M54-0.1%-1/10W) 0603
- (in symbol RESC-0603-2K05-0.1%-1/10W) 0603
- (in symbol RESC-0603-2K21-0.1%-1/10W) 0603
- (in symbol RESC-0603-2M74-0.1%-1/10W) 0603
- (in symbol RESC-0603-4M75-1%-1/10W) 0603
- (in symbol RESC-0603-10K-0.1%-1/10W) 0603
- (in symbol RESC-0603-42K2-0.1%-1/10W) 0603
- (in symbol RESC-0603-44K2-0.1%-1/10W) 0603
- (in symbol RESC-0603-511K-0.1%-1/10W) 0603
- (in symbol RESC-0805-1K54-0.1%-1/4W) 0805
- (in symbol RESC-0805-2K49-0.1%-1/4W) 0805
- (in symbol RESC-1206-1K8-0.1%-1/2W) 1206
- (in symbol RESC-1206-20R-0.1%-1/2W) 1206
- (in symbol RESC-1206-180R-0.1%-1/2W) 1206

### Library data of the parts
C26 C28 = CAPP-AE-47uF-100V-TH050P100D140H: CAPACITOR,ALU,47uF,100V,TH,P5mm,D10mm,H14mm; Manufacturer 1: KEMET; Manufacturer Part Number 1: ESL476M100AH9AA; Location: *; DIGIKEY: 399-15746-ND
C27 = CAPC-0603-10PF-50V-C0G: CAPACITOR,CERAMIC,10pF,50V,C0G,0603; Manufacturer 1: KYOCERA; Manufacturer Part Number 1: C0603C100J5GAC; Package / Case: 0603; Location: *; MOUSER: 80-C0603C100J5GAC
C68-C71 C83 C84 = CAPC-0603-100nF-50V-X7R: as C1 on sheet FrontPanel; Package / Case: 0603; Location: *; Supplier 1: Mouser; Supplier Part Number 1: 80-C0603C104K5R7867; Supplier 2: Mouser; Supplier Part Number 2: 80-C0603C104K5R7411; Supplier 3: Avnet; Supplier Part Number 3: KGM15BR71H104KT; Supplier 4: Digikey; Supplier Part Number 4: 1276-1000-1-ND; LCSC: C127833; MOUSER: 80-C0603C104K5R
C81 = CAPC-0603-1n5-50V-X7R: CAPACITOR,CERAMIC,1n5,50V,X7R,0603; Package / Case: 0603; Location: *
D34 D35 D215 D231 = DIODE-ONSEMI-NRVA4007T3G: as D60 on sheet PSU; DIGIKEY: NRVA4007T3GOSCT-ND; Manufacturer 1: ONSEMI; Manufacturer Part Number 1: NRVA4007T3G
D36 D37 = DIODE-RECTIFIER-DIODES-BAS16-SOT23: as D41 on sheet PSU
HS9 = HEATSINK-CUI-HSS01-B20-CP: HEATSINKSTAMPED,CLIP-ON,BOARDMOUNT,3W,25C/W,CUI,HSS01-B20-CP; DIGIKEY: HSS01-B20-CP; Manufacturer 1: CUI; Manufacturer Part Number 1: HSS01-B20-CP
K1 K2 = RELAY-KEMET-UA2-5NJ: RELAY,DPDT,1A,250VAC,220VDC,5V COIL,KEMET,UA2-5NJ; DIGIKEY: 399-UA2-5NJ-ND; Manufacturer 1: KEMET; Manufacturer Part Number 1: UA2-5NJ
Q9 Q10 = XSTR-NPN-BC847: XSTR,NPN,45V,0.1A,,BC847B,SOT23
R78 R107 VR211 = TRIMMER-BOURNS-3214X-1-103E: RESISTOR,MULTITURN,VERTICAL,5T,10K; Manufacturer 1: BOURNS; Manufacturer Part Number 1: 3214X-1-102E
R79 R316 = RESC-0603-2M74-0.1%-1/10W: RESISTOR,2M74,0.1%,100mW,0603 (1608); Location: *
R80 R103 = RESC-0603-44K2-0.1%-1/10W: RESISTOR,44K2,0.1%,100mW,0603 (1608); Location: *
R81 R86 = RESC-0603-2K21-0.1%-1/10W: RESISTOR,2K21,0.1%,100mW,0603 (1608); Location: *
R82 R87 = RESC-1206-1K8-0.1%-1/2W: RESISTOR,1K8,1206,0.1%,520mW,1206; Manufacturer 1: VISHAY; Manufacturer Part Number 1: TNPW12061K80BEEA; Location: *; Parameter 4: *
R83 R88 = RESC-1206-180R-0.1%-1/2W: RESISTOR,180,1206,0.1%,520mW,1206; Manufacturer 1: VISHAY; Manufacturer Part Number 1: TNPW1206180RBEEA; Location: *; Parameter 4: *
R84 R85 R89-R92 R97 R98 = RESC-1206-20R-0.1%-1/2W: RESISTOR,20R,1206,0.1%,520mW,1206; Manufacturer 1: VISHAY; Manufacturer Part Number 1: TNPW120620R0BEEA; Location: *; Parameter 4: *
R93 = RESC-0805-2K49-0.1%-1/4W: RESISTOR,2K49,0.1%,250mW,0805; Manufacturer 1: TE; Manufacturer Part Number 1: RP73PF2A2K49BTDF; Location: *; Parameter 4: *
R94 R95 = RESC-0805-1K54-0.1%-1/4W: RESISTOR,1K54,0.1%,250mW,0805; Manufacturer 1: TE; Manufacturer Part Number 1: RP73PF2A1K54BTDF; Location: *; Parameter 4: *
R96 R99 R100 = TRIMMER-BOURNS-3214X-1-102E: RESISTOR,MULTITURN,VERTICAL,5T,1K; Manufacturer 1: BOURNS; Manufacturer Part Number 1: 3214X-1-102E
R101 R102 R242 R243 = RESC-0603-10K-0.1%-1/10W: RESISTOR,10K,0.1%,100mW,0603 (1608); Manufacturer 1: PANASONIC; Manufacturer Part Number 1: ERA-3AEB103V; Location: *; DIGIKEY: P10KDBCT-ND
R104 = RESC-0603-511K-0.1%-1/10W: RESISTOR,511K,0.1%,100mW,0603 (1608); Location: *
R105 = RESC-0603-1M54-0.1%-1/10W: RESISTOR,1M54,0.1%,100mW,0603 (1608); Location: *
R106 R108 = RESC-0603-2K05-0.1%-1/10W: RESISTOR,2K05,0.11%,100mW,0603 (1608); Location: *
R241 = RESC-0603-4M75-1%-1/10W: RESISTOR,4M75,0.1%,100mW,0603 (1608); Location: *
R257 = RESC-0603-1K-0.1%-1/10W: RESISTOR,1K,0.1%,100mW,0603 (1608); Location: *
R261 = RESC-0603-42K2-0.1%-1/10W: RESISTOR,42K2,0.1%,100mW,0603 (1608); Location: *
R314 = RESC-0603-1K27-0.1%-1/10W: RESISTOR,1K27,0.1%,100mW,0603 (1608); Location: *
U11 = IC-TI-LM675-TO220-5: IC,OPAMP,SINGLE,POWER,LM675,TO220-5
U13 U213 = IC-TI-CD4053-SPLIT: IC,LOGIC,CMOS,4XXX,TRIPLE 2:1 MUX,SPLIT BLOCKS
U30-U32 = IC-TI-TL082H-SO8: IC,OPAMP JFET,DUAL,TL082HIDR,SO8; Manufacturer 1: TI; Manufacturer Part Number 1: TL082HIDR; MOUSER: 595-TL082HIDR
VR202 = TRIMMER-BOURNS-3214X-1-104: RESISTOR,MULTITURN,VERTICAL,5T,100K; Manufacturer 1: BOURNS; Manufacturer Part Number 1: 3214X-1-102E